# EAGLE board SP-PC-1 (EAGLE 7.6.0), part 1 of 2
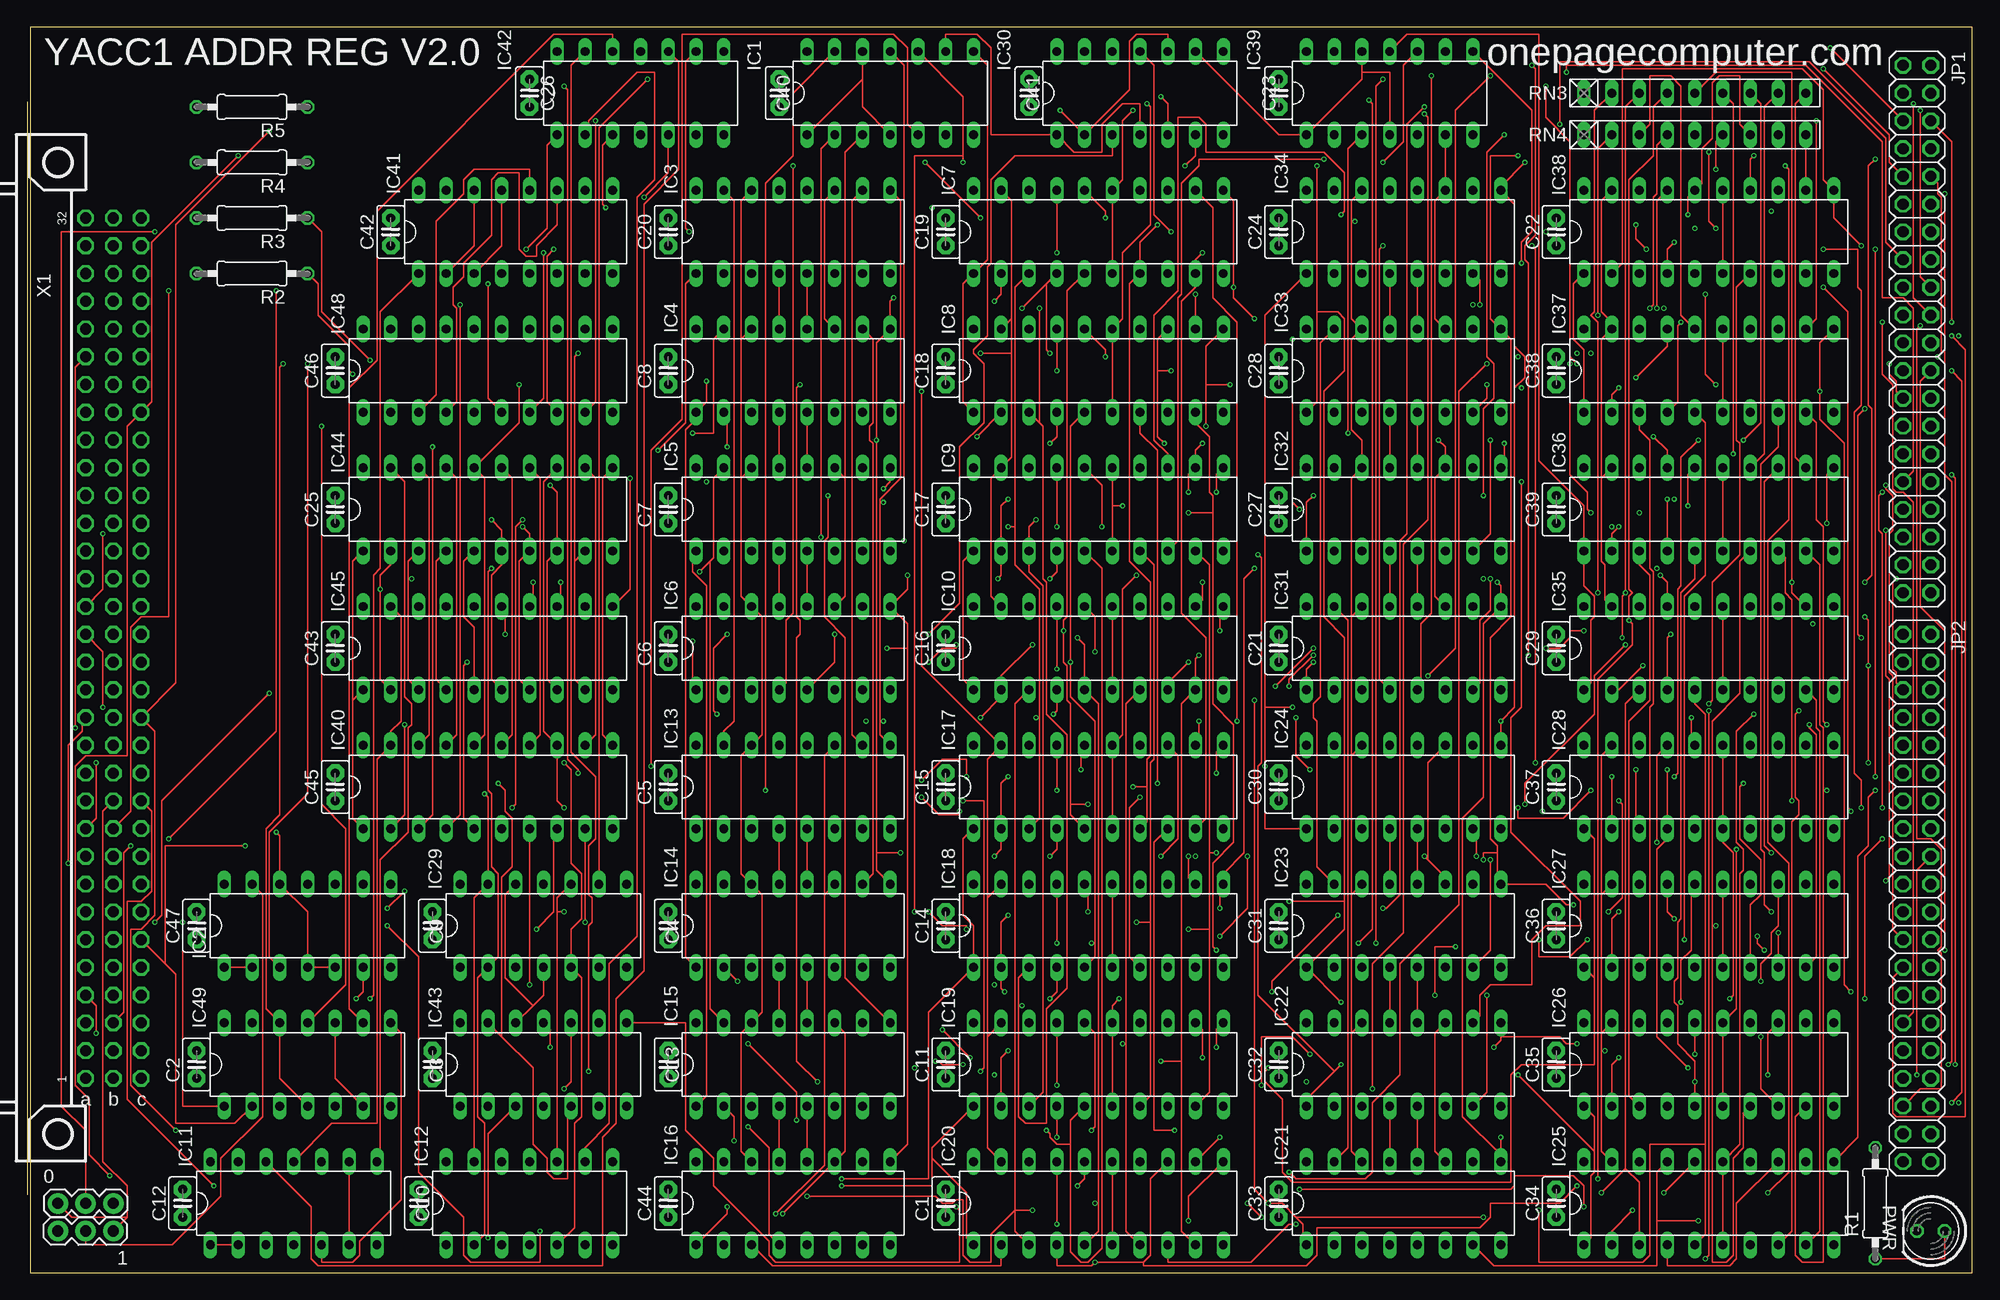
[diagram p8: board, top side]
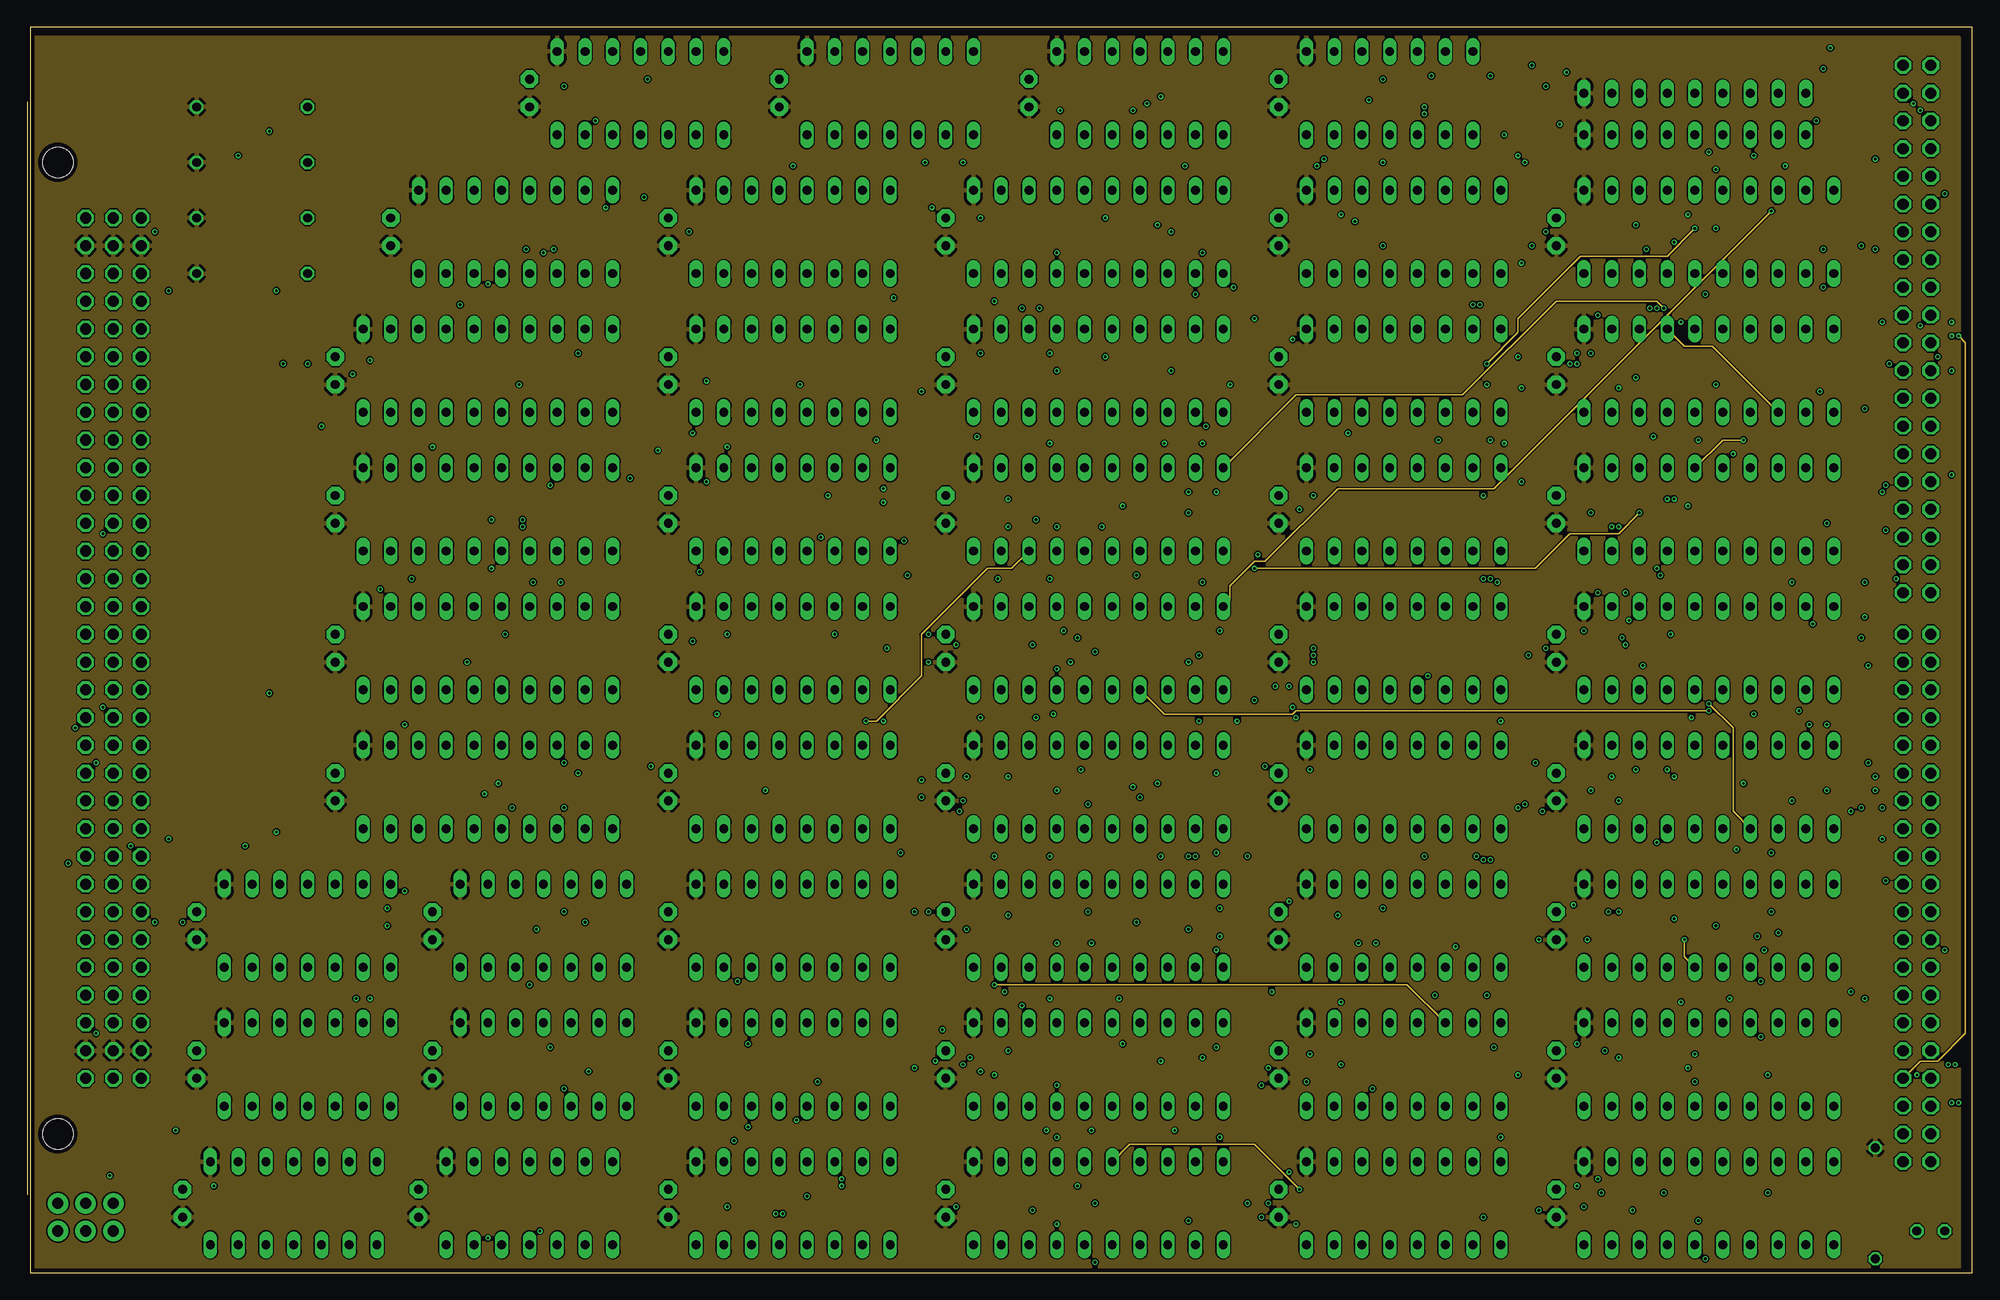
[diagram p9: board, inner layer Route2]
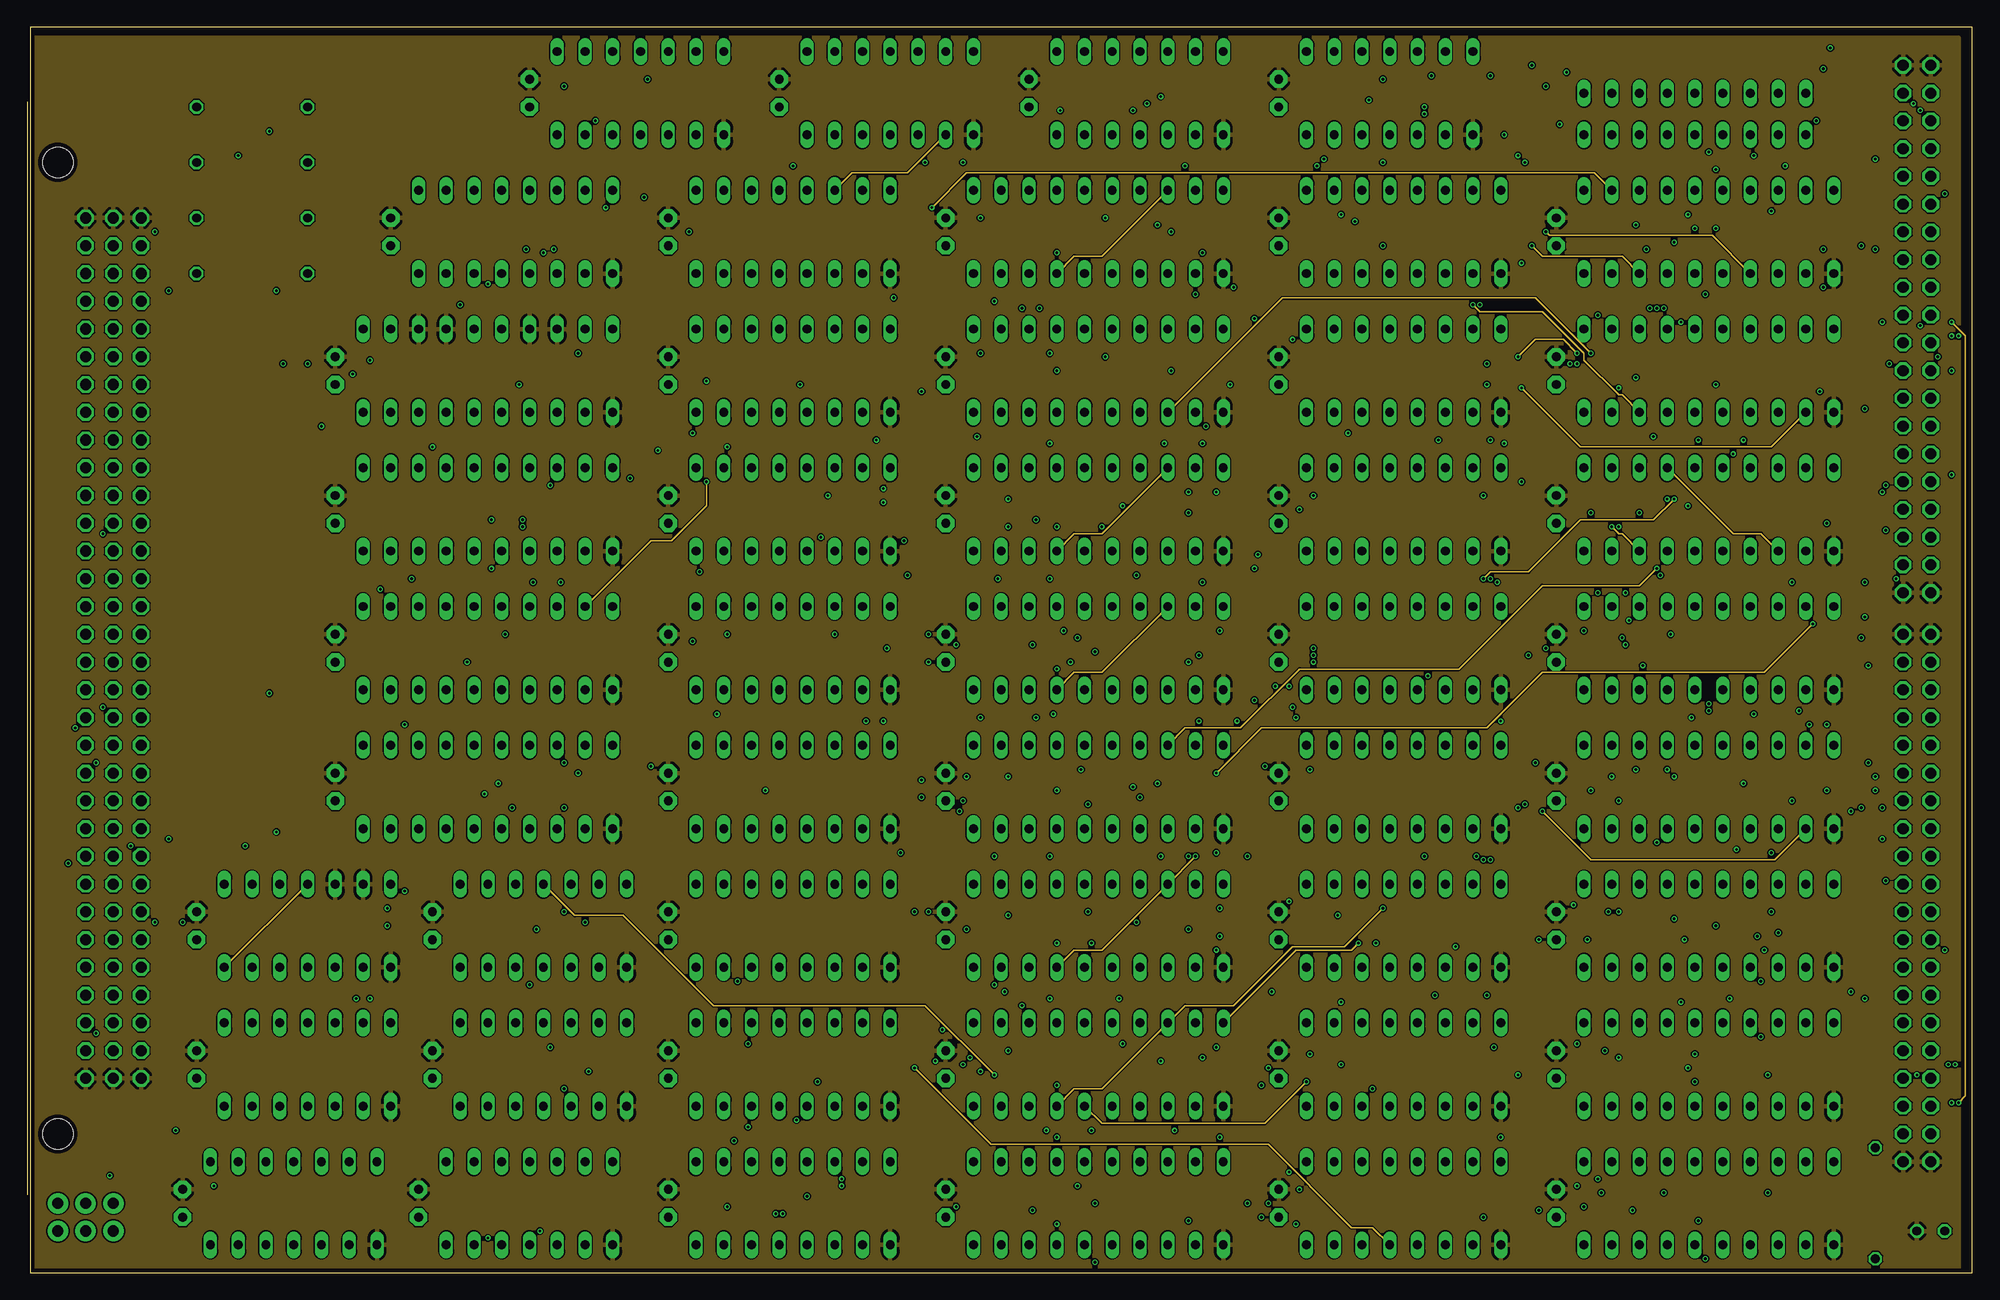
[diagram p10: board, inner layer Route15]
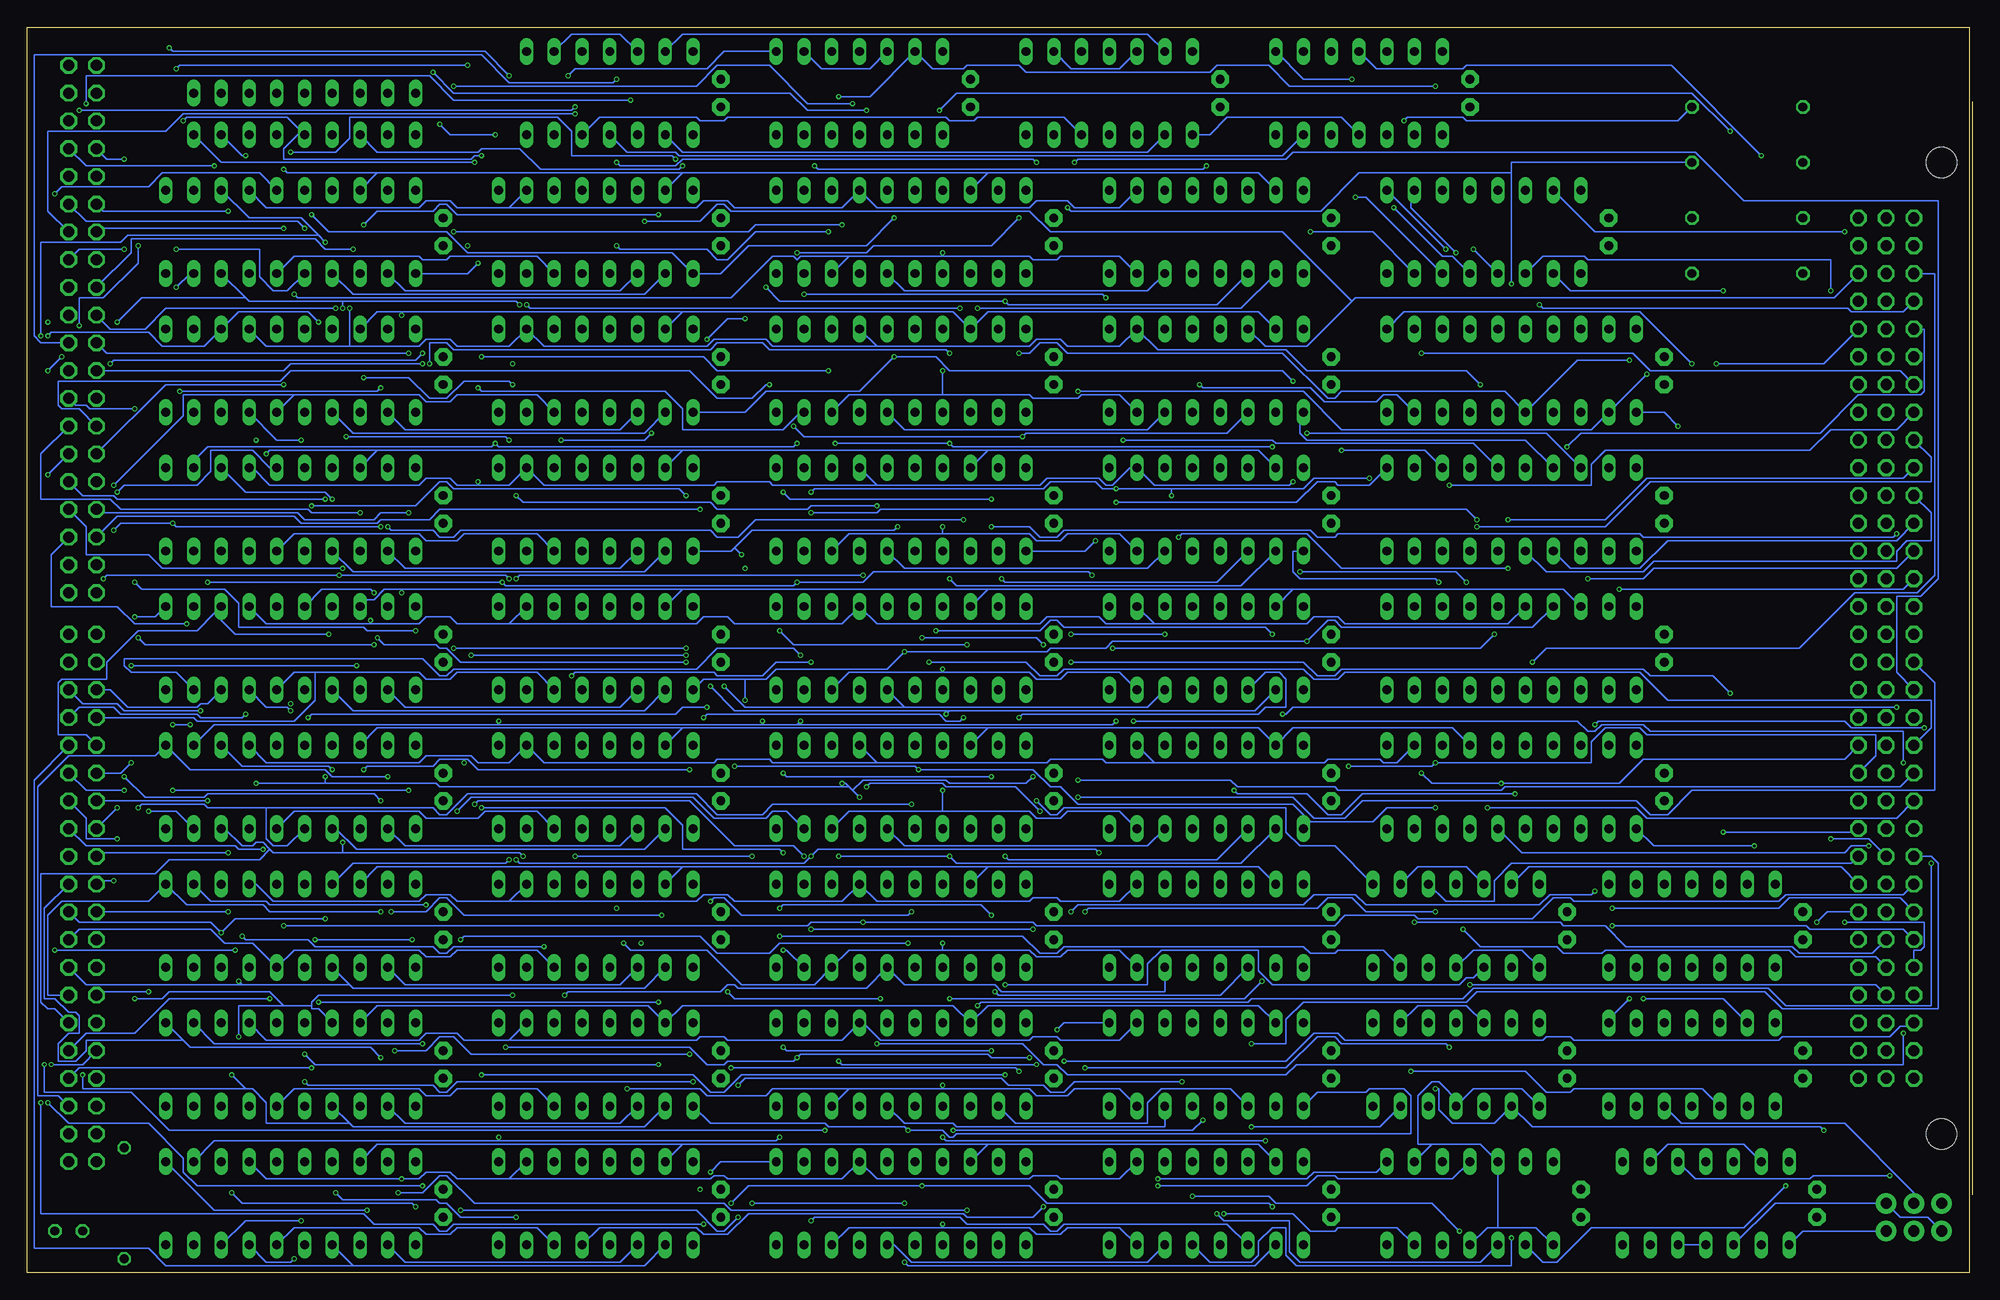
[diagram p11: board, bottom side, seen from below]

Size 177.78 x 113.97 mm. Coordinates in mm from the lower left corner, seen from the top.
Outline: 0,0 177.78,0 177.78,113.97 0,113.97 0,0
Copper layers (1*2*15*16): Top 0.035559375mm / dielectric 0.17018125mm / Route2 0.01778125mm / dielectric 47mil / Route15 0.01778125mm / dielectric 0.17018125mm / Bottom 0.035559375mm
Design rules "YACC1-OSHPark-4layer": minimum track width 5mil, minimum drill 10mil, track to track 5mil, track to pad 5mil, pad to pad 5mil, via to via 5mil, smd to smd 5mil, copper to edge 15mil, drill to drill 6mil, minimum pad ring 4mil, minimum via ring 4mil, stop-mask expansion 2.5mil, vias tented up to drill 0mil, thermal gap 10mil

## Footprints (pad centres in the part's own frame; a part is rotated, then mirrored left to right if it is on the bottom)
1X03 = drill 1.016 pad 1.88: 1 0,0; 2 2.54,0; 3 5.08,0
C2.5-2 = drill 0.813 pad 1.6 octagon: 1 -1.27,0; 2 1.27,0
DIL14 = drill 0.813 long: 1 -7.62,-3.81; 2 -5.08,-3.81; 3 -2.54,-3.81; 4 0,-3.81; 5 2.54,-3.81; 6 5.08,-3.81; 7 7.62,-3.81; 8 7.62,3.81; 9 5.08,3.81; 10 2.54,3.81; 11 0,3.81; 12 -2.54,3.81; 13 -5.08,3.81; 14 -7.62,3.81
DIL16 = drill 0.813 long: 1 -8.89,-3.81; 2 -6.35,-3.81; 3 -3.81,-3.81; 4 -1.27,-3.81; 5 1.27,-3.81; 6 3.81,-3.81; 7 6.35,-3.81; 8 8.89,-3.81; 9 8.89,3.81; 10 6.35,3.81; 11 3.81,3.81; 12 1.27,3.81; 13 -1.27,3.81; 14 -3.81,3.81; 15 -6.35,3.81; 16 -8.89,3.81
DIL20 = drill 0.813 long: 1 -11.43,-3.81; 2 -8.89,-3.81; 3 -6.35,-3.81; 4 -3.81,-3.81; 5 -1.27,-3.81; 6 1.27,-3.81; 7 3.81,-3.81; 8 6.35,-3.81; 9 8.89,-3.81; 10 11.43,-3.81; 11 11.43,3.81; 12 8.89,3.81; 13 6.35,3.81; 14 3.81,3.81; 15 1.27,3.81; 16 -1.27,3.81; 17 -3.81,3.81; 18 -6.35,3.81; 19 -8.89,3.81; 20 -11.43,3.81
2X20 = drill 1.016 octagon: 1 -24.13,-1.27; 2 -24.13,1.27; 3 -21.59,-1.27; 4 -21.59,1.27; 5 -19.05,-1.27; 6 -19.05,1.27; 7 -16.51,-1.27; 8 -16.51,1.27; 9 -13.97,-1.27; 10 -13.97,1.27; 11 -11.43,-1.27; 12 -11.43,1.27; 13 -8.89,-1.27; 14 -8.89,1.27; 15 -6.35,-1.27; 16 -6.35,1.27; 17 -3.81,-1.27; 18 -3.81,1.27; 19 -1.27,-1.27; 20 -1.27,1.27; 21 1.27,-1.27; 22 1.27,1.27; 23 3.81,-1.27; 24 3.81,1.27; 25 6.35,-1.27; 26 6.35,1.27; 27 8.89,-1.27; 28 8.89,1.27; 29 11.43,-1.27; 30 11.43,1.27; 31 13.97,-1.27; 32 13.97,1.27; 33 16.51,-1.27; 34 16.51,1.27; 35 19.05,-1.27; 36 19.05,1.27; 37 21.59,-1.27; 38 21.59,1.27; 39 24.13,-1.27; 40 24.13,1.27
LED5MM = drill 0.813 octagon: A -1.27,0; K 1.27,0
0207/10 = drill 0.813 octagon: 1 -5.08,0; 2 5.08,0
RN-9 = drill 0.813 long: 1 -10.16,0; 2 -7.62,0; 3 -5.08,0; 4 -2.54,0; 5 0,0; 6 2.54,0; 7 5.08,0; 8 7.62,0; 9 10.16,0
FABC96R = drill 1.016 octagon: A1 -2.54,39.37; A2 -2.54,36.83; A3 -2.54,34.29; A4 -2.54,31.75; A5 -2.54,29.21; A6 -2.54,26.67; A7 -2.54,24.13; A8 -2.54,21.59; A9 -2.54,19.05; A10 -2.54,16.51; A11 -2.54,13.97; A12 -2.54,11.43; A13 -2.54,8.89; A14 -2.54,6.35; A15 -2.54,3.81; A16 -2.54,1.27; A17 -2.54,-1.27; A18 -2.54,-3.81; A19 -2.54,-6.35; A20 -2.54,-8.89; A21 -2.54,-11.43; A22 -2.54,-13.97; A23 -2.54,-16.51; A24 -2.54,-19.05; A25 -2.54,-21.59; A26 -2.54,-24.13; A27 -2.54,-26.67; A28 -2.54,-29.21; A29 -2.54,-31.75; A30 -2.54,-34.29; A31 -2.54,-36.83; A32 -2.54,-39.37; B1 -5.08,39.37; B2 -5.08,36.83; B3 -5.08,34.29; B4 -5.08,31.75; B5 -5.08,29.21; B6 -5.08,26.67; B7 -5.08,24.13; B8 -5.08,21.59; B9 -5.08,19.05; B10 -5.08,16.51; B11 -5.08,13.97; B12 -5.08,11.43; B13 -5.08,8.89; B14 -5.08,6.35; B15 -5.08,3.81; B16 -5.08,1.27; B17 -5.08,-1.27; B18 -5.08,-3.81; B19 -5.08,-6.35; B20 -5.08,-8.89; B21 -5.08,-11.43; B22 -5.08,-13.97; B23 -5.08,-16.51; B24 -5.08,-19.05; B25 -5.08,-21.59; B26 -5.08,-24.13; B27 -5.08,-26.67; B28 -5.08,-29.21; B29 -5.08,-31.75; B30 -5.08,-34.29; B31 -5.08,-36.83; B32 -5.08,-39.37; C1 -7.62,39.37; C2 -7.62,36.83; C3 -7.62,34.29; C4 -7.62,31.75; C5 -7.62,29.21; C6 -7.62,26.67; C7 -7.62,24.13; C8 -7.62,21.59; C9 -7.62,19.05; C10 -7.62,16.51; C11 -7.62,13.97; C12 -7.62,11.43; C13 -7.62,8.89; C14 -7.62,6.35; C15 -7.62,3.81; C16 -7.62,1.27; C17 -7.62,-1.27; C18 -7.62,-3.81; C19 -7.62,-6.35; C20 -7.62,-8.89; C21 -7.62,-11.43; C22 -7.62,-13.97; C23 -7.62,-16.51; C24 -7.62,-19.05; C25 -7.62,-21.59; C26 -7.62,-24.13; C27 -7.62,-26.67; C28 -7.62,-29.21; C29 -7.62,-31.75; C30 -7.62,-34.29; C31 -7.62,-36.83; C32 -7.62,-39.37 | hole 2.794: 0,-44.456; 0,44.456

## Placement (x,y rotation side)
0  [1X03]  2.54,6.35 0 top
1  [1X03]  7.62,3.81 180 top
C1  0.1  [C2.5-2]  83.82,6.35 90 top
C2  0.1  [C2.5-2]  15.24,19.05 90 top
C3  0.1  [C2.5-2]  36.83,19.05 90 top
C4  0.1  [C2.5-2]  58.42,31.75 90 top
C5  0.1  [C2.5-2]  58.42,44.45 90 top
C6  0.1  [C2.5-2]  58.42,57.15 90 top
C7  0.1  [C2.5-2]  58.42,69.85 90 top
C8  0.1  [C2.5-2]  58.42,82.55 90 top
C9  0.1  [C2.5-2]  36.83,31.75 90 top
C10  0.1  [C2.5-2]  35.56,6.35 90 top
C11  0.1  [C2.5-2]  83.82,19.05 90 top
C12  0.1  [C2.5-2]  13.97,6.35 90 top
C13  0.1  [C2.5-2]  58.42,19.05 90 top
C14  0.1  [C2.5-2]  83.82,31.75 90 top
C15  0.1  [C2.5-2]  83.82,44.45 90 top
C16  0.1  [C2.5-2]  83.82,57.15 90 top
C17  0.1  [C2.5-2]  83.82,69.85 90 top
C18  0.1  [C2.5-2]  83.82,82.55 90 top
C19  0.1  [C2.5-2]  83.82,95.25 90 top
C20  0.1  [C2.5-2]  58.42,95.25 90 top
C21  0.1  [C2.5-2]  114.3,57.15 90 top
C22  0.1  [C2.5-2]  139.7,95.25 90 top
C23  0.1  [C2.5-2]  114.3,107.95 90 top
C24  0.1  [C2.5-2]  114.3,95.25 90 top
C25  0.1  [C2.5-2]  27.94,69.85 90 top
C26  0.1  [C2.5-2]  45.72,107.95 90 top
C27  0.1  [C2.5-2]  114.3,69.85 90 top
C28  0.1  [C2.5-2]  114.3,82.55 90 top
C29  0.1  [C2.5-2]  139.7,57.15 90 top
C30  0.1  [C2.5-2]  114.3,44.45 90 top
C31  0.1  [C2.5-2]  114.3,31.75 90 top
C32  0.1  [C2.5-2]  114.3,19.05 90 top
C33  0.1  [C2.5-2]  114.3,6.35 90 top
C34  0.1  [C2.5-2]  139.7,6.35 90 top
C35  0.1  [C2.5-2]  139.7,19.05 90 top
C36  0.1  [C2.5-2]  139.7,31.75 90 top
C37  0.1  [C2.5-2]  139.7,44.45 90 top
C38  0.1  [C2.5-2]  139.7,82.55 90 top
C39  0.1  [C2.5-2]  139.7,69.85 90 top
C40  0.1  [C2.5-2]  68.58,107.95 90 top
C41  0.1  [C2.5-2]  91.44,107.95 90 top
C42  0.1  [C2.5-2]  33.02,95.25 90 top
C43  0.1  [C2.5-2]  27.94,57.15 90 top
C44  0.1  [C2.5-2]  58.42,6.35 90 top
C45  0.1  [C2.5-2]  27.94,44.45 90 top
C46  0.1  [C2.5-2]  27.94,82.55 90 top
C47  0.1  [C2.5-2]  15.24,31.75 90 top
IC1  7400N  [DIL14]  78.74,107.95 0 top
IC2  7400N  [DIL14]  25.4,31.75 0 top
IC3  74LS192N  [DIL16]  69.85,95.25 0 top
IC4  74LS192N  [DIL16]  69.85,82.55 0 top
IC5  74LS192N  [DIL16]  69.85,69.85 0 top
IC6  74LS192N  [DIL16]  69.85,57.15 0 top
IC7  74LS244N  [DIL20]  97.79,95.25 0 top
IC8  74LS244N  [DIL20]  97.79,82.55 0 top
IC9  74LS244N  [DIL20]  97.79,69.85 0 top
IC10  74LS244N  [DIL20]  97.79,57.15 0 top
IC11  7400N  [DIL14]  24.13,6.35 0 top
IC12  7400N  [DIL14]  45.72,6.35 0 top
IC13  74LS192N  [DIL16]  69.85,44.45 0 top
IC14  74LS192N  [DIL16]  69.85,31.75 0 top
IC15  74LS192N  [DIL16]  69.85,19.05 0 top
IC16  74LS192N  [DIL16]  69.85,6.35 0 top
IC17  74LS244N  [DIL20]  97.79,44.45 0 top
IC18  74LS244N  [DIL20]  97.79,31.75 0 top
IC19  74LS244N  [DIL20]  97.79,19.05 0 top
IC20  74LS244N  [DIL20]  97.79,6.35 0 top
IC21  74LS192N  [DIL16]  125.73,6.35 0 top
IC22  74LS192N  [DIL16]  125.73,19.05 0 top
IC23  74LS192N  [DIL16]  125.73,31.75 0 top
IC24  74LS192N  [DIL16]  125.73,44.45 0 top
IC25  74LS244N  [DIL20]  153.67,6.35 0 top
IC26  74LS244N  [DIL20]  153.67,19.05 0 top
IC27  74LS244N  [DIL20]  153.67,31.75 0 top
IC28  74LS244N  [DIL20]  153.67,44.45 0 top
IC29  7400N  [DIL14]  46.99,31.75 0 top
IC30  7400N  [DIL14]  101.6,107.95 0 top
IC31  74LS192N  [DIL16]  125.73,57.15 0 top
IC32  74LS192N  [DIL16]  125.73,69.85 0 top
IC33  74LS192N  [DIL16]  125.73,82.55 0 top
IC34  74LS192N  [DIL16]  125.73,95.25 0 top
IC35  74LS244N  [DIL20]  153.67,57.15 0 top
IC36  74LS244N  [DIL20]  153.67,69.85 0 top
IC37  74LS244N  [DIL20]  153.67,82.55 0 top
IC38  74LS244N  [DIL20]  153.67,95.25 0 top
IC39  7400N  [DIL14]  124.46,107.95 0 top
IC40  74LS245N  [DIL20]  41.91,44.45 0 top
IC41  74LS139N  [DIL16]  44.45,95.25 0 top
IC42  74LS04N  [DIL14]  55.88,107.95 0 top
IC43  7400N  [DIL14]  46.99,19.05 0 top
IC44  74LS245N  [DIL20]  41.91,69.85 0 top
IC45  74LS245N  [DIL20]  41.91,57.15 0 top
IC48  74LS374N  [DIL20]  41.91,82.55 0 top
IC49  74LS32N  [DIL14]  25.4,19.05 0 top
JP1  [2X20]  172.72,86.36 270 top
JP2  [2X20]  172.72,34.29 270 top
PWR  l1  [LED5MM]  173.99,3.81 180 top
R1  330  [0207/10]  168.91,6.35 90 top
R2  10k  [0207/10]  20.32,91.44 180 top
R3  10k  [0207/10]  20.32,96.52 180 top
R4  10k  [0207/10]  20.32,101.6 180 top
R5  10k  [0207/10]  20.32,106.68 180 top
RN3  [RN-9]  152.4,107.95 0 top
RN4  [RN-9]  152.4,104.14 0 top
X1  FABC96R  [FABC96R]  2.54,57.15 180 top

## Tracks (layer width: path | path; a pad name or v marks a point on that pad's centre or on a via)
-BRD-SEL  (via drill 0.25)
  Top 0.127: v11.43,95.25 2.86,95.25 2.86,15.24 5.08,13.02 0.2
  Bottom 0.127: IC49.5 26.35,13.65 11.43,13.65 5.08,7.3 0.2 | IC41.15 34.29,95.25 v11.43,95.25
-BUS-EN  (via drill 0.25)
  Top 0.127: IC49.4 22.86,17.78 IC49.12 21.59,24.13 21.59,40.64 22.86,41.91 22.86,82.87 v23.18,83.19
  Bottom 0.127: X1.C28 13.34,83.19 v23.18,83.19
-INDIRECT0  (via drill 0.25)
  Top 0.127: v56.2,98.42 58.42,100.65 IC42.5
  Bottom 0.127: IC41.6 55.24,98.42 v56.2,98.42
-INDIRECT1  (via drill 0.25)
  Top 0.127: v60.33,95.25 60.01,95.57 60.01,110.81 IC42.9
  Bottom 0.127: IC41.7 54.61,95.25 v60.33,95.25
-IREG0-ADDR-OUT  (via drill 0.25)
  Top 0.127: IC35.19 144.15,61.59 144.15,64.77 143.83,65.09 143.83,72.71 | IC36.19 143.83,72.71 | 143.83,72.71 143.83,85.41 IC37.19 144.78,87 143.83,87.95 143.83,98.11 IC38.19 | IC48.6 41.91,80.01 v41.91,90.49
  Route15 0.127: IC38.19 143.19,100.65 85.72,100.65 v82.55,97.47
  Bottom 0.127: 41.91,100.65 41.91,101.6 R4.1 | 41.91,100.65 v41.91,90.49 | v82.55,97.47 82.23,97.16 59.37,97.16 55.88,100.65 41.91,100.65
-IREG1-ADDR-OUT  (via drill 0.25)
  Top 0.127: IC25.19 143.83,11.11 143.83,20.32 | 143.83,21.91 143.83,20.32 | IC26.19 143.83,21.91 | 143.83,34.61 IC27.19 | 143.83,21.91 143.83,34.61 | IC28.19 143.83,47.31 143.83,34.61 | IC48.9 51.75,79.69 v51.75,105.41 | v144.15,20.32 143.83,20.32 | v117.16,20 115.57,21.59 112.71,21.59 v112.71,17.14 | v72.07,17.46 70.17,19.37 70.17,58.1 70.48,58.42 70.48,59.69 70.17,60.01 70.17,80.96 v70.48,81.28
  Bottom 0.127: v51.75,105.41 51.44,105.73 46.35,105.73 46.04,105.41 26.67,105.41 R5.1 | v144.15,20.32 141.29,20.32 140.02,21.59 138.75,21.59 137.16,20 v117.16,20 | v112.71,17.14 112.08,17.78 88.58,17.78 87.95,17.14 84.77,17.14 84.14,16.51 82.87,16.51 81.92,17.46 v72.07,17.46 | v70.48,81.28 70.17,80.96 60.33,80.96 59.05,79.69 54.29,79.69 53.66,80.33 52.39,80.33 IC48.9
-PC-ADDR-OUT  (via drill 0.25)
  Top 0.127: v29.53,82.23 29.21,82.55 29.21,84.77 26.35,87.63 26.35,90.49 R2.1 | IC20.19 87.63,11.43 87.63,21.59 | IC19.19 87.63,21.59 | 87.63,34.29 IC18.19 | 87.63,21.59 87.63,34.29 | 87.63,34.29 87.63,46.99 IC17.19 81.6,55.56 v81.6,80.64
  Bottom 0.127: v29.53,82.23 IC48.2 34.61,77.15 57.47,77.15 60.96,80.64 v81.6,80.64
-SP  (via drill 0.25)
  Top 0.127: v52.7,97.47 52.39,97.79 52.39,103.19 IC42.3
  Bottom 0.127: IC41.5 47.31,93.03 48.26,93.03 v52.7,97.47
-SP-ADDR-OUT  (via drill 0.25)
  Top 0.127: v31.11,83.5 26.67,87.95 26.67,95.25 R3.1 | IC10.19 87.95,61.91 87.95,72.71 IC9.19 89.85,74.61 89.85,84.14 | 89.85,87.31 IC8.19 | 89.85,87.31 89.85,98.11 IC7.19 | 89.85,87.31 89.85,84.14 | 89.85,84.14 v87,84.14
  Bottom 0.127: v31.11,83.5 35.88,83.5 IC48.5 42.55,80.64 57.47,80.64 58.1,80.01 58.74,80.01 62.87,84.14 82.55,84.14 83.5,85.09 85.09,85.09 86.04,84.14 v87,84.14
-SPC  (via drill 0.25)
  Top 0.127: v45.4,93.66 47.31,95.57 47.31,103.19 IC42.1
  Bottom 0.127: v45.4,93.66 IC41.4
-UNUSED1
  Bottom 0.127: IC11.3 17.78,6.35 0.3 6.35,5.08 3.81,5.08 1.3
ADATA0  (via drill 0.25)
  Top 0.127: RN3.2 143.19,106.36 143.19,87.95 142.88,87.63 143.51,87 v143.51,62.23 | IC21.15 120.65,11.43 120.65,59.69 IC31.15
  Bottom 0.127: IC16.15 65.09,11.75 89.85,11.75 | IC20.18 89.85,11.75 | 117.79,11.75 IC21.15 | 89.85,11.75 117.79,11.75 | IC25.18 145.73,11.75 117.79,11.75 | IC45.18 37.15,62.55 61.91,62.55 | IC6.15 61.91,62.55 | 89.85,62.55 IC10.18 | 61.91,62.55 89.85,62.55 | 117.79,62.55 IC31.15 | 89.85,62.55 117.79,62.55 | IC35.18 146.69,61.59 146.05,61.59 145.1,62.55 143.51,62.55 | 117.79,62.55 143.51,62.55 | 143.51,62.55 v143.51,62.23
ADATA1  (via drill 0.25)
  Top 0.127: IC16.1 63.82,5.4 v63.82,6.03 | v95.89,7.94 96.52,8.57 IC20.16 | IC21.1 116.52,2.86 116.52,4.45 115.89,5.08 | 115.89,5.08 114.62,6.35 v113.35,6.35 112.08,7.62 v112.08,52.39 | v149.54,7.3 IC25.16 | 115.89,5.08 v133.03,5.08 | RN3.3 146.05,106.68 v146.05,62.23 145.73,61.91 v145.73,58.1 | IC10.16 97.47,60.01 v97.47,56.83 | IC6.1 60.64,53.66 v60.64,57.78 | v117.47,55.88 116.84,55.24 IC31.1
  Bottom 0.127: v63.82,6.03 64.14,6.35 84.45,6.35 86.04,7.94 v95.89,7.94 111.76,7.94 v113.35,6.35 | v149.54,7.3 148.91,6.67 140.34,6.67 140.02,6.35 139.38,6.35 138.11,5.08 v133.03,5.08 | v146.05,62.23 146.37,62.55 150.81,62.55 IC35.16 | 112.08,54.29 115.89,54.29 IC31.1 | 112.08,54.29 110.17,54.29 109.22,55.24 99.06,55.24 v97.47,56.83 84.45,56.83 84.14,57.15 79.06,57.15 78.42,57.78 v60.64,57.78 58.74,59.69 58.1,59.69 57.47,59.05 40.01,59.05 IC45.17 | v145.73,58.1 145.1,57.47 140.34,57.47 140.02,57.15 139.38,57.15 138.11,55.88 v117.47,55.88 | 112.08,54.29 v112.08,52.39
ADATA2  (via drill 0.25)
  Top 0.127: RN3.4 148.59,106.68 148.59,102.23 146.37,100.01 146.37,62.55 146.69,62.23 146.37,61.91 v146.37,59.69 146.69,59.37 146.69,57.47 143.51,54.29 v143.51,8.57
  Bottom 0.127: IC16.10 77.79,8.57 83.19,8.57 83.5,8.89 85.72,8.89 86.04,8.57 100.01,8.57 IC20.14 103.19,8.57 113.67,8.57 113.98,8.89 114.94,8.89 115.25,8.57 133.67,8.57 | 133.67,8.57 IC21.10 | 133.67,8.57 138.43,8.57 139.06,9.21 141.29,9.21 141.92,8.57 v143.51,8.57 155.89,8.57 IC25.14 | IC45.16 42.23,59.37 57.15,59.37 57.78,60.01 60.01,60.01 60.64,59.37 74.61,59.37 | IC6.10 74.61,59.37 | 74.61,59.37 79.06,59.37 79.69,60.01 84.45,60.01 85.09,59.37 100.01,59.37 IC10.14 103.19,59.37 113.03,59.37 113.67,60.01 115.89,60.01 116.52,59.37 133.67,59.37 | 133.67,59.37 IC31.10 | 133.67,59.37 138.43,59.37 139.06,60.01 141.29,60.01 141.92,59.37 146.37,59.37 | 146.37,59.37 155.89,59.37 IC35.14 | 146.37,59.37 v146.37,59.69
ADATA3  (via drill 0.25)
  Top 0.127: IC16.9 80.33,11.75 80.33,57.15 | 80.33,57.15 80.33,59.37 IC6.9 80.33,62.55 v80.33,63.82 | IC45.15 43.5,60.64 v43.5,58.42 | 80.33,57.15 v78.42,57.15 | RN3.5 154.31,109.86 161.29,109.86 v161.29,63.18 161.29,62.23 IC35.12 | IC10.12 107.31,61.59 v107.31,63.18 | v134.3,63.18 134.62,62.87 IC31.9 133.03,59.37 133.03,43.5 131.13,41.59 131.13,14.29 134.62,10.79 | v108.9,12.38 IC20.12 | v134.62,12.38 134.62,10.79 | 134.62,10.79 IC21.9
  Bottom 0.127: v43.5,58.42 44.77,57.15 v78.42,57.15 | v108.9,12.38 109.22,12.06 134.62,12.06 | 134.62,12.06 160.66,12.06 IC25.12 | 134.62,12.06 v134.62,12.38 | v161.29,63.18 v134.3,63.18 133.99,62.87 107.63,62.87 v107.31,63.18 101.28,63.18 100.33,64.14 80.64,64.14 v80.33,63.82
ADATA4  (via drill 0.25)
  Top 0.127: IC45.14 46.04,61.28 v46.04,63.18 | 62.23,65.09 62.55,65.41 62.55,72.71 IC5.15 | 62.23,65.09 v61.28,64.14 | RN3.6 155.89,107 v155.89,74.93 | IC15.15 62.23,24.13 62.23,65.09
  Bottom 0.127: IC15.15 65.09,24.45 89.85,24.45 IC19.18 93.03,24.45 117.79,24.45 IC22.15 120.97,24.45 145.73,24.45 IC26.18 | v46.04,63.18 46.99,64.14 v61.28,64.14 | 89.85,75.25 IC9.18 | 89.85,75.25 65.09,75.25 IC5.15 | 117.79,75.25 IC32.15 | 89.85,75.25 117.79,75.25 | 145.73,75.25 IC36.18 | 117.79,75.25 145.73,75.25 | v155.89,74.93 155.57,75.25 145.73,75.25
ADATA5  (via drill 0.25)
  Top 0.127: IC15.1 61.91,16.19 61.91,62.87 60.64,64.14 60.64,65.72 IC5.1 | IC45.13 48.58,61.28 v48.58,63.18 | v156.84,76.2 158.43,77.79 158.43,107 RN3.7 | IC9.16 98.11,72.07 v98.11,68.26 | IC19.16 97.47,21.91 97.47,13.34 v97.16,13.02 | v152.4,20 IC26.16 | 119.38,18.41 116.84,15.88 IC22.1 | 119.38,18.41 v120.02,19.05 | v112.39,65.72 112.71,65.41 112.71,46.67 112.39,46.35 112.39,25.4 119.38,18.41 | IC36.16 151.76,73.03 v151.76,70.17 | v117.47,71.12 116.84,70.48 IC32.1
  Route2 0.127: IC36.16 154.94,76.2 v156.84,76.2
  Bottom 0.127: v48.58,63.18 48.9,63.5 61.28,63.5 61.91,64.14 61.91,66.04 IC5.1 | v98.11,68.26 98.42,67.94 111.44,67.94 113.03,66.36 | 113.03,66.36 113.35,66.04 IC32.1 | IC22.1 115.25,13.65 104.78,13.65 104.46,13.34 97.47,13.34 v97.16,13.02 93.98,13.02 93.34,12.38 93.03,12.38 92.71,12.7 51.12,12.7 51.12,16.19 51.75,16.83 54.93,16.83 55.24,16.51 59.69,16.51 IC15.1 | v152.4,20 151.45,19.05 v120.02,19.05 | v112.39,65.72 113.03,66.36 | v151.76,70.17 142.24,70.17 140.02,72.39 139.38,72.39 138.75,71.75 118.11,71.75 v117.47,71.12
ADATA6  (via drill 0.25)
  Top 0.127: RN3.8 158.75,106.68 158.75,74.93 IC36.14 | IC22.10 132.72,23.5 132.72,25.4 133.67,26.35 137.48,26.35 137.48,30.48 138.75,31.75 141.92,31.75 141.92,33.97 135.57,40.32 135.57,50.8 136.53,51.75 v136.53,72.39
  Route15 0.127: IC45.12 56.83,66.99 58.74,66.99 61.91,70.17 v61.91,72.39
  Bottom 0.127: IC15.10 77.79,21.27 83.19,21.27 83.5,21.59 85.72,21.59 86.04,21.27 99.69,21.27 101.28,22.86 IC19.14 103.19,21.27 113.67,21.27 113.98,21.59 116.2,21.59 116.52,21.27 133.67,21.27 | 133.67,21.27 IC22.10 | 133.67,21.27 137.79,21.27 138.43,21.91 141.29,21.91 141.92,21.27 155.89,21.27 IC26.14 | 136.53,72.07 138.43,72.07 139.06,72.71 141.29,72.71 141.92,72.07 155.57,72.07 157.16,73.66 IC36.14 | 136.53,72.07 133.67,72.07 IC32.10 130.49,72.07 114.94,72.07 114.62,72.39 109.86,72.39 109.54,72.07 100.01,72.07 | v61.91,72.39 62.23,72.07 74.61,72.07 IC5.10 76.83,73.66 78.42,72.07 79.06,72.07 79.69,72.71 84.45,72.71 85.09,72.07 100.01,72.07 | 100.01,72.07 IC9.14 | 136.53,72.07 v136.53,72.39
ADATA7  (via drill 0.25)
  Top 0.127: IC32.9 134.94,73.98 v134.94,75.88 | RN3.9 161.61,107 161.61,74.61 IC36.12 | IC19.12 107.31,22.23 v107.31,19.68 | v133.99,20.64 134.62,21.27 134.62,21.59 | IC22.9 134.62,21.59 | v141.6,20.95 140.65,20.95 140.02,21.59 134.62,21.59 | IC45.11 54.93,62.55 v54.93,72.71 | v78.11,71.75 78.74,72.39 IC5.9 | IC15.9 74.61,26.99 74.61,58.1 72.71,60.01 72.71,66.99 73.03,67.31 v73.03,71.12 | v106.05,71.44 106.05,73.03 IC9.12 106.68,75.25 v107.31,75.88 | v83.5,22.23 v86.04,19.68
  Bottom 0.127: IC36.12 162.56,74.3 161.29,75.56 135.25,75.56 v134.94,75.88 134.62,75.56 107.63,75.56 v107.31,75.88 | v133.99,20.64 117.16,20.64 115.57,19.05 113.98,19.05 113.67,19.37 107.63,19.37 v107.31,19.68 107,20 89.85,20 89.53,19.68 v86.04,19.68 | IC26.12 160.66,20.95 v141.6,20.95 | v54.93,72.71 60.01,72.71 60.96,71.75 73.03,71.75 | 73.03,71.75 v78.11,71.75 79.38,71.75 80.01,72.39 84.14,72.39 84.77,71.75 105.73,71.75 v106.05,71.44 | 73.03,71.75 v73.03,71.12 | v83.5,22.23 82.87,22.86 IC15.9
ADATA8  (via drill 0.25)
  Top 0.127: IC40.18 36.51,49.21 36.51,72.71 IC44.18 | RN4.2 143.51,102.87 v143.51,87.63 | v60.64,76.83 62.55,76.83 62.55,85.41 IC4.15 | IC23.15 117.79,37.15 117.79,50.48 117.47,50.8 117.47,52.07 118.11,52.7 118.11,85.09 IC33.15
  Bottom 0.127: IC14.15 65.09,37.15 89.85,37.15 | IC18.18 89.85,37.15 | 117.79,37.15 IC23.15 | 89.85,37.15 117.79,37.15 | IC27.18 145.73,37.15 117.79,37.15 | IC4.15 65.09,87.95 89.85,87.95 IC8.18 93.03,87.95 117.79,87.95 | 117.79,87.95 IC33.15 | IC37.18 145.73,87.95 143.51,87.95 | 117.79,87.95 143.51,87.95 | 143.51,87.95 v143.51,87.63 | IC44.18 38.73,76.83 v60.64,76.83
ADATA9  (via drill 0.25)
  Top 0.127: IC40.17 39.05,49.21 39.05,72.71 IC44.17 | IC14.1 60.01,28.89 60.01,77.15 60.96,78.11 IC4.1 61.91,79.69 v61.91,81.6 | IC37.16 151.13,87.63 151.13,108.58 150.18,109.54 148.27,109.54 148.27,105.09 RN4.3 | 120.33,33.97 120.33,58.1 118.43,60.01 118.43,80.64 120.33,82.55 120.33,87.31 119.7,87.95 117.79,87.95 | 120.33,33.97 120.33,31.43 IC23.1 v120.02,24.77 | 117.79,87.95 117.79,79.69 IC33.1 | IC18.16 96.84,35.24 v96.84,33.02 | 120.33,33.97 v115.25,33.97 | IC8.16 98.42,84.45 v98.42,83.82 | IC27.16 152.08,35.24 152.08,29.53 151.13,28.57 v151.13,24.77 | 117.79,87.95 v117.79,101.28
  Bottom 0.127: IC44.17 40.64,76.2 60.64,76.2 61.28,76.83 61.28,78.74 IC4.1 | v96.84,33.02 97.16,32.7 112.39,32.7 113.98,34.29 114.94,34.29 v115.25,33.97 | IC33.1 112.08,78.74 110.17,80.64 101.6,80.64 v98.42,83.82 94.61,83.82 93.34,82.55 62.87,82.55 v61.91,81.6 | v120.02,24.77 v151.13,24.77 | RN4.3 145.73,102.55 136.53,102.55 136.21,102.87 132.72,102.87 130.81,100.97 118.11,100.97 v117.79,101.28
ADATA10  (via drill 0.25)
  Top 0.127: RN4.4 148.91,103.19 148.91,98.74 148.59,98.42 148.59,88.58 v148.27,88.27 | IC40.16 41.59,49.21 41.59,72.71 IC44.16 44.77,77.79 v44.77,81.28 | IC14.10 77.15,36.51 77.15,75.88 76.83,76.2 76.83,77.47 77.15,77.79 77.15,85.41 IC4.10
  Bottom 0.127: IC14.10 77.79,33.97 83.19,33.97 83.5,34.29 85.72,34.29 86.04,33.97 100.01,33.97 IC18.14 103.19,33.97 113.03,33.97 113.67,34.61 115.89,34.61 116.52,33.97 133.67,33.97 | 133.67,33.97 IC23.10 | 133.67,33.97 138.43,33.97 139.06,34.61 141.29,34.61 141.92,33.97 155.26,33.97 156.84,35.56 IC27.14 | 148.27,84.77 155.89,84.77 IC37.14 | 148.27,84.77 141.92,84.77 141.29,85.41 139.06,85.41 138.43,84.77 133.67,84.77 IC33.10 130.49,84.77 115.57,84.77 114.94,85.41 110.17,85.41 109.54,84.77 100.01,84.77 | 148.27,84.77 v148.27,88.27 | 100.01,84.77 86.04,84.77 85.41,85.41 83.19,85.41 82.55,84.77 77.79,84.77 IC4.10 74.3,84.45 62.55,84.45 60.64,82.55 46.04,82.55 v44.77,81.28 | IC8.14 100.01,84.77
ADATA11  (via drill 0.25)
  Top 0.127: v163.51,105.41 163.51,87.31 IC37.12 | 134.3,38.42 134.3,39.05 133.67,39.69 133.67,58.1 135.57,60.01 135.57,85.41 IC33.9 133.67,87.31 133.67,102.23 v136.21,102.23 | 134.3,38.42 134.3,35.88 IC23.9 138.75,35.56 140.65,33.66 v141.29,33.66 | IC40.15 44.13,49.21 44.13,72.71 IC44.15 | IC14.9 77.47,36.83 77.47,38.42 | 77.47,38.42 v77.47,76.2 77.47,85.09 IC4.9 78.74,88.9 v79.06,89.22 | IC18.12 106.05,36.2 v106.05,38.1 | 77.47,38.42 v79.69,38.42 | v106.68,89.53 IC8.12 | 134.3,38.42 133.03,38.42 v133.03,37.78
  Bottom 0.127: 152.72,104.46 153.99,105.73 163.19,105.73 v163.51,105.41 | IC27.12 160.97,33.97 155.89,33.97 155.57,33.66 v141.29,33.66 | 152.72,104.46 154.31,102.87 154.31,101.92 137.16,101.92 136.84,102.23 v136.21,102.23 | 152.72,104.46 RN4.5 | v79.69,38.42 80.01,38.73 105.41,38.73 v106.05,38.1 106.68,37.47 132.72,37.47 v133.03,37.78 | v106.68,89.53 79.38,89.53 v79.06,89.22 | IC44.15 45.4,75.88 63.5,75.88 63.82,76.2 v77.47,76.2
ADATA12  (via drill 0.25)
  Top 0.127: RN4.6 154.31,103.5 v154.31,100.97 | IC44.14 46.67,72.71 46.67,49.21 IC40.14 | IC3.15 64.45,98.11 64.45,50.48 63.5,49.53 IC13.15
  Bottom 0.127: IC3.15 65.09,100.65 89.85,100.65 | IC7.18 89.85,100.65 | 117.79,100.65 IC34.15 | 89.85,100.65 117.79,100.65 | 145.73,100.65 IC38.18 | 117.79,100.65 145.73,100.65 | v154.31,100.97 153.99,100.65 145.73,100.65 | IC40.14 47.31,49.85 61.91,49.85 IC13.15 65.09,49.85 89.85,49.85 | 89.85,49.85 IC17.18 | 117.79,49.85 IC24.15 | 89.85,49.85 117.79,49.85 | IC28.18 145.73,49.85 117.79,49.85
ADATA13  (via drill 0.25)
  Top 0.127: v48.9,42.55 48.26,43.18 IC40.13 46.99,49.53 46.99,72.39 IC44.13 | IC17.16 96.2,47.94 v96.2,46.04 | IC3.1 60.01,90.49 60.01,77.79 v57.47,75.25 | RN4.7 156.53,105.09 156.53,109.54 154.62,109.54 153.99,108.9 153.99,103.82 153.03,102.87 153.03,99.69 IC38.16 151.76,98.42 v151.76,96.84 | IC24.1 113.03,40.64 v113.03,46.35 113.03,51.75 | 113.03,51.75 113.03,87.63 IC34.1 | IC28.16 152.08,48.58 v152.08,50.8 | 113.03,51.75 v115.57,51.75 | IC7.16 98.42,97.16 v98.42,96.52
  Bottom 0.127: 60.33,41.27 IC13.1 | 60.33,41.27 54.61,41.27 53.34,42.55 v48.9,42.55 | 60.33,41.27 61.91,42.86 81.6,42.86 83.19,44.45 84.14,44.45 85.72,46.04 v96.2,46.04 96.52,46.35 v113.03,46.35 | v57.47,75.25 49.85,75.25 IC44.13 | v152.08,50.8 151.76,51.12 118.43,51.12 117.79,51.75 v115.57,51.75 | v98.42,96.52 100.97,93.98 111.76,93.98 114.3,91.44 IC34.1 118.75,93.34 137.48,93.34 139.38,95.25 150.18,95.25 v151.76,96.84
ADATA14  (via drill 0.25)
  Top 0.127: v157.8,102.23 157.48,101.92 IC38.14 | IC40.12 51.75,49.21 51.75,72.71 IC44.12 | IC3.10 75.25,98.11 75.25,49.21 IC13.10
  Bottom 0.127: IC3.10 77.79,97.47 81.92,97.47 82.55,98.11 85.41,98.11 86.04,97.47 100.01,97.47 IC7.14 103.19,97.47 113.03,97.47 113.67,98.11 115.89,98.11 116.52,97.47 133.67,97.47 | 133.67,97.47 IC34.10 | 133.67,97.47 138.43,97.47 139.06,98.11 141.29,98.11 141.92,97.47 155.89,97.47 IC38.14 | RN4.8 158.12,102.23 v157.8,102.23 | IC28.14 155.89,46.67 141.92,46.67 141.29,47.31 137.16,47.31 136.53,46.67 133.67,46.67 IC24.10 130.49,46.67 114.94,46.67 114.62,46.99 109.86,46.99 109.54,46.67 100.01,46.67 | 74.61,46.67 IC13.10 | 74.61,46.67 59.05,46.67 58.74,46.99 53.98,46.99 53.66,46.67 52.39,46.67 IC40.12 | 100.01,46.67 IC17.14 | 100.01,46.67 84.45,46.67 84.14,46.99 79.38,46.99 79.06,46.67 74.61,46.67
ADATA15  (via drill 0.25)
  Top 0.127: IC40.11 52.39,49.21 52.39,72.71 IC44.11 | IC13.9 77.79,49.21 77.79,50.48 | 77.79,70.48 77.79,70.8 79.69,72.71 79.69,98.11 IC3.9 | 77.79,70.48 77.79,50.48 | 77.79,70.48 v78.11,70.48 | RN4.9 IC38.12 | IC17.12 107,48.58 v107,50.48 | IC24.9 v134.62,50.48 135.89,51.75 135.89,80.96 136.84,81.92 136.84,83.82 135.89,84.77 135.89,97.79 IC34.9 134.62,99.38 v136.84,101.6 | IC7.12 108.27,97.47 108.27,89.22 110.49,87 v110.49,50.48 | v78.11,50.48 77.79,50.48
  Bottom 0.127: IC44.11 54.93,72.07 57.78,72.07 58.1,72.39 59.69,72.39 61.59,70.48 v78.11,70.48 | 107.31,50.16 v107,50.48 | 134.62,50.16 160.66,50.16 IC28.12 | 134.62,50.16 110.49,50.16 | 110.49,50.16 107.31,50.16 | 134.62,50.16 v134.62,50.48 | 110.49,50.16 v110.49,50.48 | RN4.9 160.02,101.6 v136.84,101.6 | v78.11,50.48 78.42,50.16 107.31,50.16
ADDR0  (via drill 0.25)
  Top 0.127: IC25.9 163.83,3.81 163.83,49.53 163.51,49.85 163.51,52.39 IC35.9 | IC20.9 105.41,3.81 105.41,19.37 | 105.41,19.37 105.41,52.07 IC10.9 106.68,56.2 v107,56.52 | v82.87,19.37 83.19,19.37 83.5,19.05 v85.41,19.05 | 105.41,19.37 v103.5,19.37
  Bottom 0.127: X1.A3 5.4,22.54 6.35,22.54 7.3,21.59 17.14,21.59 17.46,21.27 36.2,21.27 36.51,21.59 38.73,21.59 39.05,21.27 57.15,21.27 57.78,21.91 60.01,21.91 62.55,19.37 v82.87,19.37 | v85.41,19.05 103.19,19.05 v103.5,19.37 | IC35.9 164.15,54.93 168.28,54.93 168.91,55.56 168.91,56.2 141.6,56.2 140.02,54.61 139.38,54.61 138.75,55.24 116.52,55.24 114.62,57.15 107.63,57.15 v107,56.52
ADDR1  (via drill 0.25)
  Top 0.127: v153.35,1.27 153.67,1.59 v153.67,51.44 | IC20.7 100.33,3.81 100.33,20.95 | 100.33,20.95 100.33,52.07 IC10.7 | X1.A4 6.03,24.45 v6.03,21.91 | 100.33,20.95 v100.01,20.95
  Route2 0.127: v153.67,51.44 115.89,51.44 115.57,51.12 103.82,51.12 IC10.7
  Bottom 0.127: IC25.7 155.89,0.95 153.67,0.95 v153.35,1.27 | v153.67,51.44 153.99,51.75 155.89,51.75 IC35.7 | v6.03,21.91 6.03,19.05 61.59,19.05 62.55,18.1 82.55,18.1 83.5,19.05 84.77,19.05 86.68,20.95 v100.01,20.95
ADDR2  (via drill 0.25)
  Top 0.127: IC25.5 153.35,3.49 153.35,11.75 | 153.35,11.75 153.35,51.12 152.4,52.07 IC35.5 | IC20.5 97.79,3.81 97.79,6.35 | 97.79,6.35 97.79,52.07 IC10.5 96.52,57.47 v95.89,58.1 | v11.43,32.07 12.06,32.7 12.06,43.18 v21.91,53.02 | v82.23,55.88 83.5,57.15 84.77,57.15 v84.77,57.47 | 153.35,11.75 148.27,11.75 148.27,1.59 147.64,0.95 138.11,0.95 v138.11,5.71 | v111.44,6.35 v112.71,5.08 | 97.79,6.35 v97.47,6.35
  Bottom 0.127: X1.A5 5.08,29.53 4.45,29.53 4.13,29.84 4.13,32.07 v11.43,32.07 | v21.91,53.02 23.5,54.61 29.21,54.61 29.84,55.24 57.47,55.24 58.1,54.61 59.69,54.61 60.96,55.88 v82.23,55.88 | v84.77,57.47 85.41,58.1 v95.89,58.1 | v138.11,5.71 116.52,5.71 114.62,3.81 113.98,3.81 v112.71,5.08 | v97.47,6.35 v111.44,6.35
ADDR3  (via drill 0.25)
  Top 0.127: IC25.3 147.32,8.26 146.05,9.53 | 146.05,9.53 146.05,52.07 IC35.3 | IC20.3 90.17,3.81 90.17,5.71 | 90.17,5.71 90.17,52.07 IC10.3 | v32.7,31.75 35.56,28.89 35.56,9.21 39.69,5.08 39.69,1.59 40.32,0.95 46.67,0.95 v46.67,3.81 | v71.12,6.99 82.87,6.99 83.5,6.35 84.45,6.35 84.77,6.67 85.41,6.67 85.41,1.59 86.04,0.95 87.95,0.95 87.95,3.49 90.17,5.71 | v143.83,7.3 146.05,9.53 | 90.17,5.71 v91.76,5.71
  Bottom 0.127: X1.A6 6.03,31.43 14.61,31.43 14.92,31.75 v32.7,31.75 | v46.67,3.81 49.21,6.35 63.5,6.35 64.14,6.99 v71.12,6.99 | v143.83,7.3 141.6,7.3 140.02,8.89 139.38,8.89 136.84,6.35 113.98,6.35 113.35,5.71 v91.76,5.71
ADDR4  (via drill 0.25)
  Top 0.127: IC26.9 161.61,14.29 161.61,1.59 162.24,0.95 164.15,0.95 164.15,44.13 | 164.15,44.13 164.15,49.85 163.83,50.16 163.83,64.77 IC36.9 | IC19.9 107.95,16.51 107.95,31.43 | 107.95,38.42 107.95,64.77 IC9.9 | 107.95,38.42 107.95,31.43 | v34.29,34.92 v32.7,33.34 | v82.23,33.02 83.5,31.75 85.72,31.75 v85.72,31.43 | 107.95,31.43 v106.05,31.43 | v164.47,44.13 164.15,44.13 | v142.88,44.13 140.34,41.59 136.21,41.59 v136.21,42.55 | 107.95,38.42 v108.58,38.42
  Bottom 0.127: X1.A7 6.35,34.29 16.51,34.29 17.46,33.34 v32.7,33.34 | v34.29,34.92 34.61,34.61 38.42,34.61 39.37,33.66 55.24,33.66 56.2,34.61 60.01,34.61 60.96,33.66 81.6,33.66 v82.23,33.02 | v106.05,31.43 v85.72,31.43 | v142.88,44.13 v164.47,44.13 | v136.21,42.55 119.38,42.55 117.79,40.96 117.79,38.73 108.9,38.73 v108.58,38.42
ADDR5  (via drill 0.25)
  Top 0.127: IC26.7 156.84,14.61 156.84,11.43 155.89,10.48 155.89,1.59 155.26,0.95 153.99,0.95 153.99,31.75 | 153.99,31.75 153.99,50.48 156.53,53.02 156.53,65.09 IC36.7 | IC19.7 102.55,16.19 102.55,32.07 | 102.55,32.07 102.55,46.67 102.87,46.99 102.87,64.77 IC9.7 | 102.55,32.07 v101.28,32.07 | v154.31,31.75 153.99,31.75
  Bottom 0.127: X1.A8 6.03,34.61 16.83,34.61 17.46,33.97 36.2,33.97 36.51,34.29 38.1,34.29 40.01,32.38 50.48,32.38 50.8,32.7 57.15,32.7 58.1,31.75 85.41,31.75 85.72,32.07 v101.28,32.07 106.05,32.07 106.36,31.75 v154.31,31.75
ADDR6  (via drill 0.25)
  Top 0.127: IC26.5 v152.4,17.46 152.4,19.37 150.81,20.95 150.81,24.45 150.5,24.77 150.5,26.67 150.81,26.99 150.81,32.07 151.13,32.38 151.13,62.23 152.4,63.5 IC36.5 | IC19.5 95.25,13.97 95.25,11.75 | 95.25,11.75 95.25,1.91 96.2,0.95 96.84,0.95 98.11,2.22 98.11,64.45 IC9.5 | v65.72,20.95 70.17,16.51 v70.17,13.97 | v93.03,13.02 93.34,12.7 93.34,12.38 93.98,11.75 95.25,11.75
  Route15 0.127: v116.84,17.46 113.03,13.65 98.11,13.65 IC19.5
  Bottom 0.127: X1.A9 3.49,38.1 2.86,37.47 2.86,24.13 17.14,24.13 18.73,25.72 45.09,25.72 46.04,24.77 60.96,24.77 62.55,23.18 62.55,20.95 v65.72,20.95 | v70.17,13.97 71.12,13.02 v93.03,13.02 | v152.4,17.46 152.08,17.14 140.65,17.14 140.02,16.51 139.38,16.51 138.43,17.46 v116.84,17.46
ADDR7  (via drill 0.25)
  Top 0.127: IC26.3 146.37,16.19 146.37,50.48 148.27,52.39 148.27,63.82 147.32,64.77 IC36.3 | IC19.3 92.71,16.51 92.71,62.87 91.44,64.14 IC9.3 91.44,68.26 v92.08,68.9 | X1.A10 6.03,41.59 v6.03,46.67
  Route2 0.127: v76.52,50.48 77.47,50.48 81.6,54.61 81.6,58.42 87.63,64.45 89.85,64.45 IC9.3
  Route15 0.127: IC36.3 145.73,67.63 145.41,67.63 v144.78,68.26
  Bottom 0.127: v6.03,46.67 6.03,49.53 29.21,49.53 29.84,50.16 33.66,50.16 34.29,49.53 34.92,49.53 35.88,50.48 v76.52,50.48 | v144.78,68.26 144.46,67.94 140.65,67.94 140.02,67.31 138.75,67.31 138.11,67.94 115.25,67.94 114.62,67.31 112.71,67.31 111.12,68.9 v92.08,68.9
ADDR8  (via drill 0.25)
  Top 0.127: IC27.9 163.51,28.89 163.51,49.21 162.88,49.85 v162.88,50.16 | v164.47,50.16 164.15,50.48 164.15,68.26 163.51,68.9 163.51,77.79 IC37.9 | v108.58,29.53 108.27,29.84 108.27,37.47 110.17,39.37 110.17,50.16 108.27,52.07 108.27,69.53 | 108.27,69.53 108.27,71.12 107.95,71.44 107.95,76.52 106.68,77.79 IC8.9 | v44.13,42.55 44.45,42.86 44.45,68.26 v45.09,68.9 | 108.27,69.53 v106.05,69.53
  Route15 0.127: IC37.9 159.38,75.56 141.92,75.56 v136.53,80.96
  Bottom 0.127: v164.47,50.16 v162.88,50.16 | IC18.9 108.27,29.53 v108.58,29.53 | X1.A11 6.67,41.59 29.53,41.59 30.48,42.55 v44.13,42.55 | v45.09,68.9 46.04,69.85 99.69,69.85 100.01,69.53 v106.05,69.53 | v136.53,80.96 136.21,80.64 119.38,80.64 117.79,79.06 117.79,77.15 108.58,77.15 107,78.74 IC8.9
ADDR9  (via drill 0.25)
  Top 0.127: IC18.7 100.65,28.89 100.65,42.55 v101.6,43.5 | v103.19,44.77 103.19,75.25 101.6,76.83 IC8.7 | IC27.7 157.48,33.66 158.43,34.61 158.43,37.78 156.53,39.69 156.53,44.45 v156.84,44.77 | v152.72,76.2 151.13,74.61 151.13,62.87 150.81,62.55 150.81,45.72 v150.5,45.4 | v81.6,45.09 83.5,46.99 85.72,46.99 v85.72,45.4
  Bottom 0.127: 102.55,44.45 102.87,44.77 v103.19,44.77 | 102.55,44.45 102.23,44.13 | 102.23,44.13 v101.6,43.5 | 150.5,44.77 140.34,44.77 140.02,44.45 102.55,44.45 | 150.5,44.77 v156.84,44.77 | IC37.7 154.94,76.2 v152.72,76.2 | 150.5,44.77 v150.5,45.4 | X1.A12 6.35,44.45 42.55,44.45 42.86,44.13 57.78,44.13 58.1,44.45 66.99,44.45 67.63,45.09 v81.6,45.09 | v85.72,45.4 86.36,44.77 93.34,44.77 93.66,45.09 101.28,45.09 102.23,44.13
ADDR10  (via drill 0.25)
  Top 0.127: v151.45,30.48 151.45,61.91 153.35,63.82 153.35,77.79 IC37.5 | IC18.5 97.47,28.89 97.47,30.16 | 97.47,30.16 97.47,50.48 95.25,52.7 v95.25,55.88 95.25,77.47 IC8.5 | v142.56,30.48 140.97,28.89 138.11,28.89 v138.11,30.48 | 97.47,30.16 v97.16,30.16
  Route2 0.127: IC27.5 151.45,28.89 v151.45,30.48
  Bottom 0.127: X1.A13 3.49,49.85 3.49,52.39 27.62,52.39 30.16,54.93 57.15,54.93 57.78,54.29 60.01,54.29 60.96,55.24 82.87,55.24 83.5,54.61 85.09,54.61 86.36,55.88 v95.25,55.88 | v142.56,30.48 v151.45,30.48 | v138.11,30.48 137.79,30.8 116.2,30.8 114.62,29.21 109.86,29.21 108.9,30.16 v97.16,30.16
ADDR11  (via drill 0.25)
  Top 0.127: IC27.3 148.27,28.89 148.27,51.75 148.59,52.07 148.59,64.14 148.27,64.45 148.27,76.2 147.32,77.15 IC37.3 | IC18.3 90.49,26.99 90.49,24.45 | 90.49,24.45 90.49,14.29 91.12,13.65 93.03,13.65 93.03,24.13 94.93,26.04 94.93,49.21 93.03,51.12 93.03,63.18 92.71,63.5 92.71,77.47 92.39,77.79 | IC8.3 92.39,77.79 | X1.A14 4.76,50.48 4.76,49.53 3.49,48.26 v3.49,37.47 | 90.49,24.45 v90.81,24.45 | 92.39,77.79 v92.39,88.27
  Route15 0.127: IC37.3 145.73,80.33 145.41,80.33 142.24,83.5 142.24,84.14 138.43,87.95 132.72,87.95 v132.08,88.58
  Bottom 0.127: v3.49,37.47 3.49,24.45 16.83,24.45 18.41,26.04 45.4,26.04 46.35,25.08 65.72,25.08 66.04,24.77 90.49,24.77 v90.81,24.45 | v132.08,88.58 131.76,88.27 v92.39,88.27
ADDR12  (via drill 0.25)
  Top 0.127: v166.69,42.23 166.37,42.55 166.37,87.95 v164.15,90.17 | IC17.9 107.63,41.59 107.63,58.1 105.41,60.33 105.41,88.9 106.68,90.17 IC7.9 106.68,92.71 v107.31,93.34 | v87,96.52 v81.92,101.6
  Route15 0.127: IC28.9 159.7,37.78 142.88,37.78 v138.43,42.23
  Bottom 0.127: IC28.9 164.15,42.23 v166.69,42.23 | v164.15,90.17 162.88,91.44 IC38.9 | X1.A15 6.67,54.93 6.67,61.91 4.45,61.91 2.86,63.5 2.86,98.11 20.64,98.11 25.08,102.55 61.91,102.55 62.55,101.92 81.6,101.92 v81.92,101.6 | v87,96.52 89.53,93.98 100.33,93.98 100.97,93.34 v107.31,93.34 | v138.43,42.23 137.16,43.5 116.84,43.5 114.94,41.59 110.17,41.59 109.54,42.23 108.27,42.23 IC17.9
ADDR13  (via drill 0.25)
  Top 0.127: v153.67,52.07 153.99,52.39 153.99,63.18 156.53,65.72 156.53,75.88 156.21,76.2 156.21,90.17 IC38.7 | IC17.7 102.23,41.27 102.23,44.45 | 102.23,44.45 102.23,46.99 102.55,47.31 102.55,63.18 100.65,65.09 100.65,90.49 IC7.7 101.6,94.3 v103.19,95.89 | v81.6,43.5 83.19,41.91 85.09,41.91 v85.09,42.23 | 102.23,44.45 v100.97,44.45
  Route2 0.127: IC28.7 155.89,42.23 155.89,49.85 v153.67,52.07
  Route15 0.127: IC38.7 153.99,94.93 139.06,94.93 v138.75,95.25
  Bottom 0.127: X1.A16 3.17,53.98 3.17,44.13 25.4,44.13 27.62,41.91 29.21,41.91 30.48,43.18 55.56,43.18 57.15,41.59 60.01,41.59 61.91,43.5 v81.6,43.5 | v85.09,42.23 87.31,44.45 93.66,44.45 93.98,44.77 100.65,44.77 v100.97,44.45 | v138.75,95.25 111.76,95.25 111.12,95.89 v103.19,95.89
ADDR14  (via drill 0.25)
  Top 0.127: IC17.5 95.25,41.91 95.25,42.86 | 95.25,42.86 95.25,52.07 94.93,52.39 94.93,55.56 94.61,55.88 v94.61,58.74 94.61,59.69 94.93,60.01 94.93,89.85 IC7.5 | 95.25,42.86 v96.84,42.86 | v164.15,93.66 167.32,93.66 167.32,90.17 167.64,89.85 167.64,79.38 167,78.74 167,45.72 167.64,45.09 v167.64,42.55 | X1.A17 6.67,56.83 v6.67,51.75 | v62.87,51.12 62.55,51.44 62.55,57.15 v63.82,58.42
  Bottom 0.127: IC28.5 153.99,39.05 155.26,39.05 155.89,39.69 155.89,42.55 | 155.89,42.55 140.65,42.55 140.02,41.91 139.38,41.91 137.48,43.81 116.52,43.81 114.62,41.91 110.49,41.91 109.54,42.86 v96.84,42.86 | IC38.5 153.99,89.85 155.26,89.85 156.53,91.12 156.53,93.66 v164.15,93.66 | v167.64,42.55 167.32,42.86 161.61,42.86 161.29,42.55 155.89,42.55 | v6.67,51.75 61.91,51.75 62.55,51.12 v62.87,51.12 | v63.82,58.42 64.45,59.05 82.87,59.05 83.5,59.69 84.14,59.69 85.09,58.74 v94.61,58.74
ADDR15  (via drill 0.25)
  Top 0.127: IC17.3 92.39,41.59 92.39,50.8 | 92.39,50.8 92.39,62.55 90.17,64.77 90.17,68.26 | 90.17,68.26 90.17,90.17 IC7.3 | IC28.3 147,40.96 v147,46.04 | v117.16,46.04 115.89,47.31 v115.89,50.8 | 92.39,50.8 v92.08,50.8 | v137.48,93.98 137.79,93.66 v137.79,46.67 | X1.A18 6.67,62.55 v6.67,67.63 | 90.17,68.26 v89.53,68.26
  Route15 0.127: IC38.3 145.73,93.03 138.43,93.03 v137.48,93.98
  Bottom 0.127: v147,46.04 146.69,46.35 140.65,46.35 140.02,46.99 137.79,46.99 | 137.79,46.99 137.48,46.99 136.53,46.04 v117.16,46.04 | v115.89,50.8 115.57,51.12 94.3,51.12 93.66,50.48 92.39,50.48 v92.08,50.8 | 137.79,46.99 v137.79,46.67 | v6.67,67.63 6.99,67.31 29.84,67.31 30.16,67.63 57.78,67.63 58.1,67.31 59.69,67.31 60.33,67.94 82.87,67.94 83.5,67.31 85.09,67.31 86.04,68.26 v89.53,68.26
ADDR-ID0  (via drill 0.25)
  Top 0.127: IC41.2 40.64,93.98 IC41.14 | v12.7,39.69 22.54,49.53 v22.54,89.85
  Bottom 0.127: X1.B9 9.21,39.69 v12.7,39.69 | v22.54,89.85 36.51,89.85 IC41.2
ADDR-ID1  (via drill 0.25)
  Top 0.127: IC41.3 43.18,93.98 IC41.13 | X1.B10 9.21,42.23 9.21,59.05 10.16,60.01 12.7,60.01 v12.7,89.85
  Bottom 0.127: v12.7,89.85 12.7,92.71 34.92,92.71 35.24,93.03 39.05,93.03 IC41.3
ADDR-REG-ADDR-RD  (via drill 0.25)
  Top 0.127: IC2.5 IC2.4 25.4,33.02 IC2.12 22.86,40.01 v22.54,40.32
  Bottom 0.127: X1.C10 10.48,40.32 v22.54,40.32
ADDR-REG-DATA-RD-HI  (via drill 0.25)
  Top 0.127: IC1.10 85.41,107.63 85.41,102.23 | v85.41,101.6 85.41,102.23 | v123.83,101.6 125.73,103.5 125.73,110.49 IC39.10 | 48.26,33.02 48.26,34.29 IC29.10 | 48.26,33.02 IC12.10 | 85.41,102.23 80.96,102.23 v80.96,33.02 | 48.26,33.02 v48.9,33.02
  Bottom 0.127: v85.41,101.6 85.72,101.92 117.79,101.92 118.43,101.28 123.51,101.28 v123.83,101.6 | X1.C9 10.79,37.47 41.91,37.47 43.5,35.88 43.5,33.97 47.94,33.97 IC29.10 | v80.96,33.02 80.64,33.34 59.69,33.34 58.74,34.29 56.52,34.29 55.24,33.02 v48.9,33.02
ADDR-REG-DATA-RD-LO  (via drill 0.25)
  Top 0.127: IC12.13 40.64,34.29 IC29.13 41.91,43.5 v41.59,43.81 | IC1.13 69.85,107.95 69.85,102.23 67.31,99.69 v67.31,44.13
  Bottom 0.127: IC1.13 75.25,113.35 117.79,113.35 IC39.13 | X1.C8 11.75,37.15 40.32,37.15 IC29.13 | v67.31,44.13 66.99,43.81 60.64,43.81 58.74,41.91 57.47,41.91 55.56,43.81 v41.59,43.81
ADDR-REG-DN  (via drill 0.25)
  Top 0.127: v103.5,107.63 104.14,107 IC30.5 | 43.18,21.59 46.04,18.73 46.04,11.75 47.31,10.48 47.31,9.21 47.94,8.57 49.21,8.57 49.21,14.92 IC43.5 | 43.18,21.59 IC43.13 | v42.86,44.77 43.5,44.13 43.5,42.23 44.13,41.59 44.13,37.15 43.18,36.2 43.18,21.59 | v48.9,108.58 49.21,108.27 49.21,46.99 50.16,46.04 v50.16,45.72
  Bottom 0.127: v103.5,107.63 100.65,107.63 IC30.13 94.93,110.17 92.08,110.17 91.76,110.49 87,110.49 86.36,109.86 69.53,109.86 68.9,110.49 64.14,110.49 62.23,108.58 v48.9,108.58 | X1.C13 11.43,46.99 29.84,46.99 32.07,44.77 v42.86,44.77 49.21,44.77 v50.16,45.72
ADDR-REG-FUNC
  Top 0.127: IC11.9 IC11.6
  Bottom 0.127: IC11.13 20.64,11.75 27.62,11.75 IC11.9
ADDR-REG-FUNC-LD  (via drill 0.25)
  Top 0.127: IC40.1 29.53,41.59 29.53,52.39 | IC45.1 29.53,52.39 | IC44.1 29.53,65.09 29.53,52.39 | IC49.2 18.73,13.65 13.34,13.65 13.34,27.3 12.38,28.26 | X1.C6 12.38,28.26 | v19.68,39.05 12.38,39.05 12.38,28.26
  Bottom 0.127: IC40.1 28.89,39.05 v19.68,39.05
ADDR-REG-FUNC-RD  (via drill 0.25)
  Top 0.127: IC49.1 13.97,15.24 v13.97,32.07
  Bottom 0.127: v13.97,32.07 13.02,33.02 X1.C7
ADDR-REG-LD-HI  (via drill 0.25)
  Top 0.127: IC12.5 49.85,4.13 49.85,13.65 50.48,14.29 50.48,26.99 IC29.5 49.53,31.43 50.48,32.38 50.48,36.51 49.53,37.47 49.53,46.04 v48.9,46.67 | IC1.5 80.33,105.09 80.33,112.08 79.06,113.35 59.69,113.35 59.69,78.11 56.83,75.25 v56.83,46.35
  Bottom 0.127: IC1.5 82.87,105.73 90.81,105.73 91.12,105.41 93.34,105.41 93.66,105.73 113.67,105.73 113.98,105.41 116.2,105.41 116.52,105.73 125.41,105.73 IC39.5 | X1.C12 8.57,47.31 8.57,49.21 29.53,49.21 30.16,49.85 33.34,49.85 34.61,48.58 34.61,46.67 v48.9,46.67 49.21,46.35 v56.83,46.35
ADDR-REG-LD-LO  (via drill 0.25)
  Top 0.127: IC12.2 41.59,3.49 41.59,13.65 40.96,14.29 40.96,26.99 IC29.2 42.86,28.89 42.86,36.51 42.23,37.15 42.23,43.81 41.91,44.13 41.91,64.14 v42.23,64.45 | X1.C11 11.11,42.23 11.11,34.92 10.16,33.97 8.89,33.97 8.89,15.88 v16.83,7.94 | IC1.2 72.39,102.87 v72.39,67.31
  Bottom 0.127: IC1.2 75.25,102.55 117.79,102.55 IC39.2 | v16.83,7.94 20.64,4.13 34.61,4.13 37.78,0.95 39.05,0.95 IC12.2 | v72.39,67.31 72.07,67.63 60.64,67.63 57.47,64.45 v42.23,64.45
ADDR-REG-UP  (via drill 0.25)
  Top 0.127: IC30.10 104.14,113.35 101.28,113.35 100.65,112.71 100.65,108.27 IC30.2 v94.3,106.36 | v48.9,16.83 49.53,17.46 IC43.10 | v13.34,13.02 9.21,17.14 9.21,31.43 10.16,31.43 11.43,32.7 11.43,49.53 X1.C14 13.34,53.98 13.34,95.89 v21.91,104.46
  Bottom 0.127: v48.9,16.83 48.58,16.83 48.58,14.92 47.31,13.65 43.5,13.65 IC43.2 40.01,13.34 13.65,13.34 v13.34,13.02 | v94.3,106.36 92.71,107.95 25.4,107.95 v21.91,104.46
BRD-SEL
  Top 0.127: IC2.13 21.27,34.61 21.27,14.29 17.46,10.48 17.46,6.99 13.02,2.54 5.08,2.54 1.2
DATA0  (via drill 0.25)
  Top 0.127: IC45.2 32.07,54.29 v32.07,62.55 32.07,63.82 33.02,64.77 IC44.2
  Bottom 0.127: X1.A19 6.03,62.55 v32.07,62.55
DATA1  (via drill 0.25)
  Top 0.127: IC45.3 34.61,54.29 34.61,63.5 | 34.61,63.5 34.61,65.09 IC44.3 | 34.61,63.5 v34.92,63.5
  Bottom 0.127: X1.A20 6.67,64.45 28.89,64.45 29.84,63.5 v34.92,63.5
DATA2
  Top 0.127: IC45.4 37.15,54.29 37.15,65.09 IC44.4
  Bottom 0.127: X1.A21 6.67,66.99 27.62,66.99 30.16,64.45 36.51,64.45 IC44.4
DATA3
  Top 0.127: IC45.5 40.64,59.05 39.69,60.01 39.69,65.09 IC44.5
  Bottom 0.127: X1.A22 3.49,69.53 3.49,66.99 5.71,66.99 6.67,66.04 6.67,65.09 28.89,65.09 29.84,64.14 38.73,64.14 IC44.5
DATA4  (via drill 0.25)
  Top 0.127: IC45.6 42.23,54.29 42.23,63.82 43.18,64.77 IC44.6 43.18,67.94 v42.23,68.9
  Bottom 0.127: X1.A23 6.03,72.71 29.53,72.71 33.34,68.9 v42.23,68.9
DATA5  (via drill 0.25)
  Top 0.127: IC45.7 44.77,54.29 44.77,65.09 IC44.7 45.72,67.63 v45.09,68.26
  Bottom 0.127: X1.A24 3.49,74.61 3.49,72.39 29.21,72.39 33.34,68.26 v45.09,68.26
DATA6  (via drill 0.25)
  Top 0.127: IC45.8 47.31,54.29 47.31,65.09 IC44.8 48.26,71.44 v47.62,72.07
  Bottom 0.127: X1.A25 6.67,77.15 12.7,77.15 14.61,75.25 33.34,75.25 34.61,73.98 34.61,72.07 v47.62,72.07
DATA7  (via drill 0.25)
  Top 0.127: IC45.9 49.85,54.29 49.85,65.09 | IC44.9 49.85,65.09 | v50.16,84.14 49.85,83.82 49.85,65.09
  Bottom 0.127: X1.A26 6.35,82.55 29.21,82.55 30.8,84.14 v50.16,84.14
DATA8  (via drill 0.25)
  Top 0.127: IC40.2 34.29,41.91 v34.29,50.16 | v4.13,49.85 4.13,82.87 X1.A27
  Bottom 0.127: v34.29,50.16 33.97,50.48 11.43,50.48 10.79,49.85 v4.13,49.85
DATA9  (via drill 0.25)
  Top 0.127: IC40.3 36.83,41.91 v36.83,75.56
  Bottom 0.127: v36.83,75.56 35.56,76.83 13.65,76.83 10.16,80.33 4.45,80.33 4.13,80.64 4.13,86.36 X1.A28
DATA10  (via drill 0.25)
  Top 0.127: IC40.4 39.37,41.91 v39.37,88.58
  Bottom 0.127: v39.37,88.58 39.05,88.27 11.11,88.27 10.79,87.95 6.03,87.95 X1.A29
DATA11  (via drill 0.25)
  Top 0.127: IC40.5 39.69,41.59 39.69,55.56 v40.01,55.88
  Bottom 0.127: v40.01,55.88 38.73,57.15 15.56,57.15 10.48,62.23 4.76,62.23 3.17,63.82 3.17,91.44 X1.A30
DATA12  (via drill 0.25)
  Top 0.127: v9.21,39.05 8.57,38.42 8.57,23.81 X1.B3
  Bottom 0.127: IC40.6 40.96,38.42 11.43,38.42 10.79,39.05 v9.21,39.05
DATA13  (via drill 0.25)
  Top 0.127: v45.72,26.35 IC40.7
  Bottom 0.127: v45.72,26.35 8.57,26.35 X1.B4
DATA14  (via drill 0.25)
  Top 0.127: IC40.8 47.94,40.32 47.94,33.02 v46.35,31.43
  Bottom 0.127: v46.35,31.43 44.77,29.84 37.78,29.84 37.15,29.21 33.66,29.21 33.34,29.53 16.51,29.53 15.88,28.89 8.57,28.89 X1.B5
DATA15  (via drill 0.25)
  Top 0.127: v50.8,32.07 IC40.9
  Bottom 0.127: v50.8,32.07 37.47,32.07 37.15,31.75 33.34,31.75 31.43,29.84 16.19,29.84 15.56,29.21 8.89,29.21 X1.B6
GND
  pour Route15: 1.27,113.03 176.53,113.03 176.53,0 0,0 0,113.03
H/L-SWAP  (via drill 0.25)
  Top 0.127: v7.3,8.89 5.4,10.79 5.4,15.88 4.13,17.14 4.13,46.35 5.08,47.31 8.89,47.31 8.89,77.47 X1.C25 11.11,79.69 11.11,94.3 v19.05,102.23
  Bottom 0.127: IC11.10 25.08,8.57 14.61,8.57 14.29,8.89 v7.3,8.89 | IC42.11 54.29,110.17 46.35,110.17 46.04,110.49 27.3,110.49 v19.05,102.23
IREG0
  Top 0.127: IC39.12 121.92,109.86 | 121.92,109.86 121.92,109.22 IC39.1 114.3,104.14 IC30.9 | 121.92,109.86 124.46,109.86 IC39.4
  Bottom 0.127: IC30.12 100.65,110.17 105.09,110.17 IC30.9 | IC39.9 127.95,113.35 123.51,113.35 IC39.12 | IC42.6 62.87,102.23 118.11,102.23 118.43,102.55 122.87,102.55 IC39.4
IREG1  (via drill 0.25)
  Top 0.127: 46.04,24.45 46.99,25.4 IC29.4 | 46.04,24.45 IC43.12 | v56.52,109.22 52.07,104.78 IC29.9 | 46.04,24.45 43.5,26.99 43.5,34.61 IC29.12
  Bottom 0.127: IC29.1 40.96,29.53 45.4,29.53 IC29.4 | IC43.9 50.48,24.45 46.04,24.45 IC43.12 | IC29.12 46.04,37.15 50.48,37.15 IC29.9 | IC42.8 60.96,109.22 v56.52,109.22
N$1
  Top 0.127: IC49.9 29.21,24.13 29.21,80.96 31.75,83.5 31.75,97.16 47.94,113.35 53.34,113.35 IC42.12
N$2
  Top 0.127: IC22.4 IC21.13
N$3
  Top 0.127: IC22.5 IC21.12
N$4
  Top 0.127: IC23.4 IC22.13
N$5
  Top 0.127: IC23.5 IC22.12
N$6
  Top 0.127: IC24.4 IC23.13
N$7
  Top 0.127: IC24.5 IC23.12
N$8  (via drill 0.25)
  Top 0.127: IC21.11 128.59,11.11 128.59,21.91 IC22.11
  Route2 0.127: v88.27,26.35 126.05,26.35 IC22.11
  Bottom 0.127: IC29.3 45.4,26.99 46.04,26.99 46.67,26.35 63.82,26.35 65.09,27.62 65.09,29.53 73.98,29.53 75.25,28.26 75.25,26.35 v88.27,26.35
N$9  (via drill 0.25)
  Top 0.127: IC43.8 60.01,22.86 60.01,13.02 62.55,10.48 62.55,7.94 67.63,2.86 67.63,1.59 68.26,0.95 85.09,0.95 85.09,5.71 v84.77,6.03
  Bottom 0.127: v84.77,6.03 85.72,5.08 91.76,5.08 92.08,5.4 111.76,5.4 113.67,3.49 115.89,3.49 116.52,4.13 125.41,4.13 IC21.5
N$10
  Top 0.127: IC5.4 IC6.13
N$11
  Top 0.127: IC5.5 IC6.12
N$12
  Top 0.127: IC4.4 IC5.13
N$13
  Top 0.127: IC4.5 IC5.12
N$14
  Top 0.127: IC3.4 IC4.13
N$15
  Top 0.127: IC3.5 IC4.12
N$16
  Top 0.127: IC6.11 74.61,61.91 74.61,72.71 | IC5.11 74.61,72.71 | IC1.3 74.61,102.55 74.61,72.71
N$17  (via drill 0.25)
  Top 0.127: IC6.5 73.66,55.88 v73.66,58.42 | v82.23,58.42 85.09,61.28 85.09,75.56 87.31,77.79 87.31,83.19 86.36,84.14 86.36,84.45 87.63,85.72 87.63,92.08 87.95,92.39 87.95,100.01 90.17,102.23 99.06,102.23 IC30.3
  Bottom 0.127: v82.23,58.42 v73.66,58.42
N$18  (via drill 0.25)
  Top 0.127: IC6.4 69.22,53.98 69.22,59.69 69.85,60.33 v69.85,101.28 | v105.73,101.28 106.68,102.23 IC30.6
  Bottom 0.127: v69.85,101.28 70.17,100.97 105.41,100.97 v105.73,101.28
N$19  (via drill 0.25)
  Top 0.127: IC2.3 21.91,28.89 21.91,40.32 25.4,43.81 v25.4,83.19
  Bottom 0.127: v25.4,83.19 30.16,87.95 51.75,87.95 IC48.11
N$20  (via drill 0.25)
  Top 0.127: IC10.1 85.41,54.29 85.41,65.09 IC9.1 | IC1.11 80.01,110.49 v80.01,66.99
  Bottom 0.127: v80.01,66.99 80.96,66.04 IC9.1
N$21
  Top 0.127: IC8.1 85.41,79.69 85.41,90.49 IC7.1 87.63,92.71 87.63,110.49 IC1.8
N$22
  Top 0.127: IC4.11 72.71,87.31 72.71,98.11 IC3.11
  Route15 0.127: IC1.6 80.33,100.65 75.25,100.65 IC3.11
N$23  (via drill 0.25)
  Top 0.127: IC43.11 47.62,22.23 v47.62,20.64
  Route15 0.127: v80.96,18.73 87.95,11.75 113.35,11.75 120.97,4.13 122.87,4.13 IC21.4
  Bottom 0.127: v47.62,20.64 47.94,20.95 57.47,20.95 58.1,21.59 59.69,21.59 62.55,18.73 v80.96,18.73
N$24
  Top 0.127: IC2.2 IC2.1
  Route15 0.127: IC2.1 IC2.11
N$25  (via drill 0.25)
  Top 0.127: IC25.1 142.88,3.17 142.88,8.89 143.19,9.21 143.19,11.11 | 143.19,11.11 143.19,14.29 IC26.1 | 143.19,11.11 v136.21,18.1
  Route15 0.127: IC29.11 49.85,32.7 54.29,32.7 62.55,24.45 81.92,24.45 v88.27,18.1
  Bottom 0.127: v88.27,18.1 112.39,18.1 113.98,16.51 115.25,16.51 116.84,18.1 v136.21,18.1
N$26  (via drill 0.25)
  Top 0.127: v85.41,43.18 87.31,43.18 87.31,18.73 v87,18.41 | v113.35,18.73 113.03,18.41 113.03,17.46 114.62,15.88 114.62,9.21 115.57,8.26 135.57,8.26 135.57,18.1 136.53,19.05 143.19,19.05 143.19,26.99 | IC27.1 143.19,26.99 | IC28.1 143.19,39.69 143.19,26.99
  Bottom 0.127: IC29.8 58.1,39.05 61.28,39.05 62.55,40.32 62.55,42.55 82.87,42.55 83.5,41.91 84.14,41.91 v85.41,43.18 | v87,18.41 87.31,18.73 v113.35,18.73
N$27  (via drill 0.25)
  Top 0.127: v108.9,30.8 111.44,33.34 v111.44,38.1 | 127.95,37.78 129.54,36.2 IC23.11 | 127.95,37.78 v127.64,38.1 | IC24.11 127.95,46.67 127.95,37.78
  Bottom 0.127: IC29.6 53.66,29.53 57.78,29.53 58.1,29.21 60.33,29.21 60.96,29.84 82.87,29.84 83.5,29.21 85.09,29.21 86.68,30.8 v108.9,30.8 | v127.64,38.1 v111.44,38.1
N$28
  Top 0.127: IC32.4 IC31.13
N$29
  Top 0.127: IC32.5 IC31.12
N$30
  Top 0.127: IC33.4 IC32.13
N$31
  Top 0.127: IC33.5 IC32.12
N$32
  Top 0.127: IC34.4 IC33.13
N$33
  Top 0.127: IC34.5 IC33.12
N$34  (via drill 0.25)
  Top 0.127: IC31.11 128.59,61.91 128.59,72.71 IC32.11 129.54,75.56 v128.91,76.2 | IC39.3 120.65,102.87 v120.65,76.83
  Bottom 0.127: v120.65,76.83 121.28,76.2 v128.91,76.2
N$35  (via drill 0.25)
  Top 0.127: IC31.5 127.32,53.66 127.32,59.37 128.27,60.33 v128.27,109.54
  Bottom 0.127: v128.27,109.54 127.64,110.17 115.57,110.17 113.98,111.76 IC30.8
N$36  (via drill 0.25)
  Top 0.127: IC31.4 123.51,54.29 123.51,93.66 v123.83,93.98 | v104.46,95.25 102.87,96.84 102.87,110.49 IC30.11
  Bottom 0.127: v123.83,93.98 123.51,93.66 115.57,93.66 114.62,92.71 113.67,92.71 111.12,95.25 v104.46,95.25
N$37  (via drill 0.25)
  Top 0.127: IC49.8 33.97,21.91 33.97,6.67 30.16,2.86 30.16,1.59 29.53,0.95 26.67,0.95 IC11.5 | IC41.1 32.07,87.95 32.07,64.45 31.43,63.82 31.43,25.4 v31.11,25.08
  Bottom 0.127: IC11.5 IC11.4 | v31.11,25.08 33.02,23.18 IC49.8
N$38
  Top 0.127: IC35.1 142.88,53.98 142.88,59.69 143.19,60.01 143.19,61.91 142.24,62.87 IC36.1 142.24,70.17 138.11,74.3 138.11,113.35 126.05,113.35 IC39.11
N$39  (via drill 0.25)